# EAGLE board PKG900000001531 (EAGLE 7.7.0), part 1 of 3
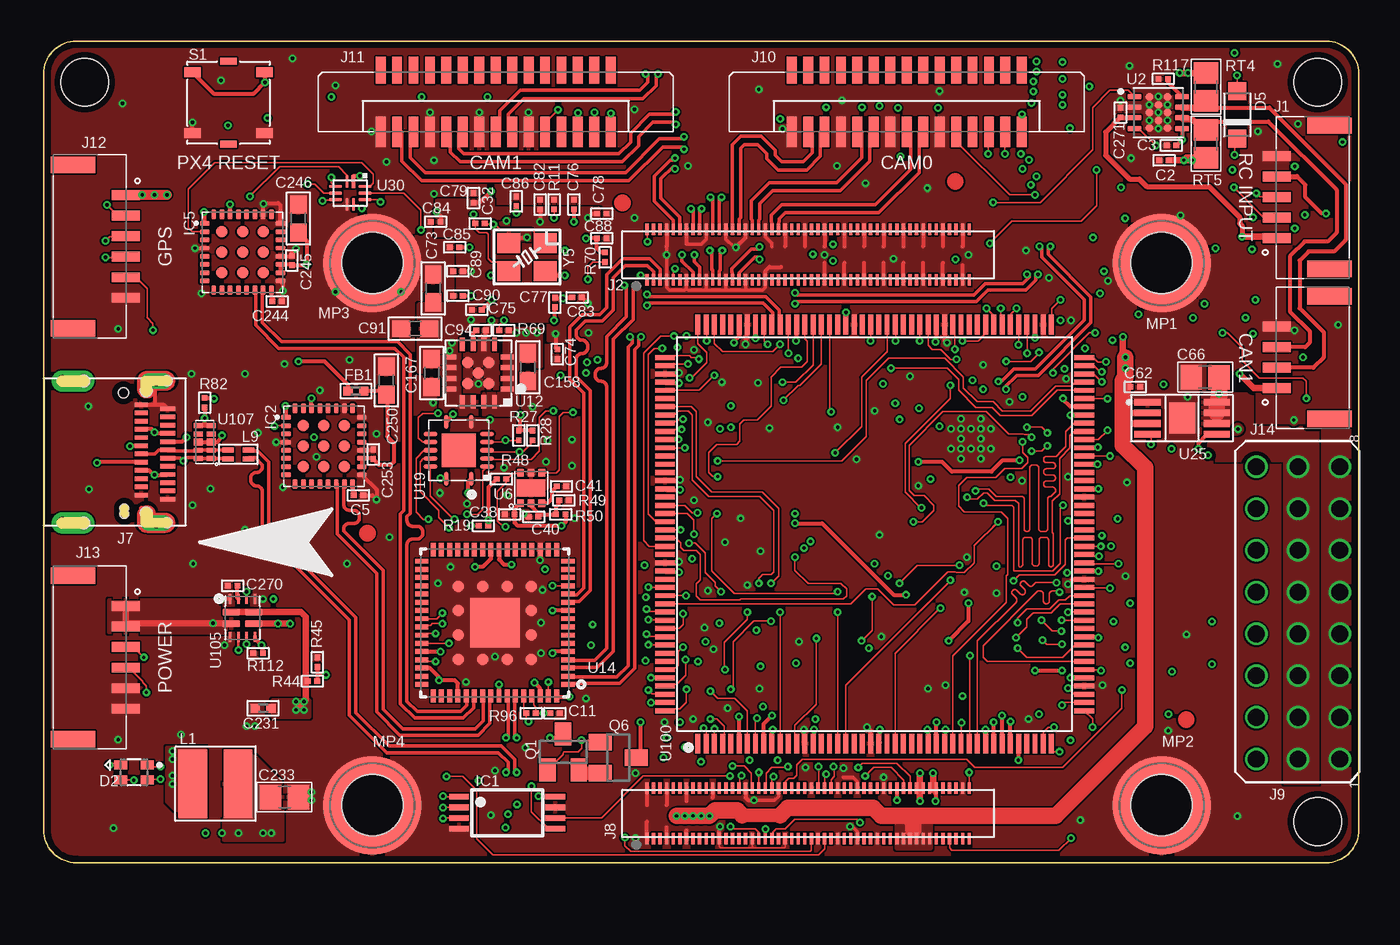
[diagram p32: board, top side]
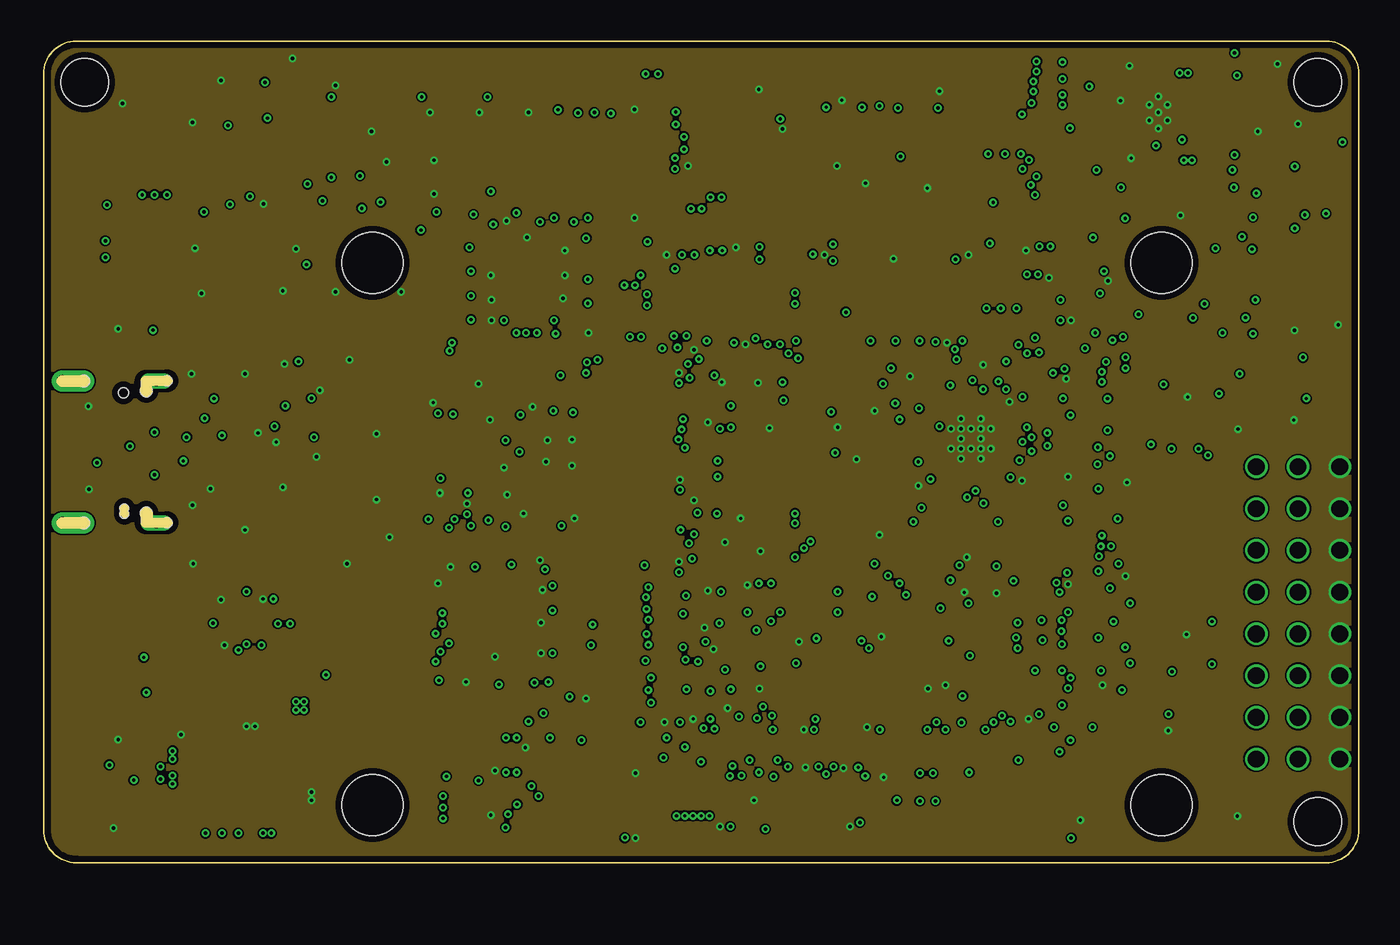
[diagram p33: board, inner layer GND]
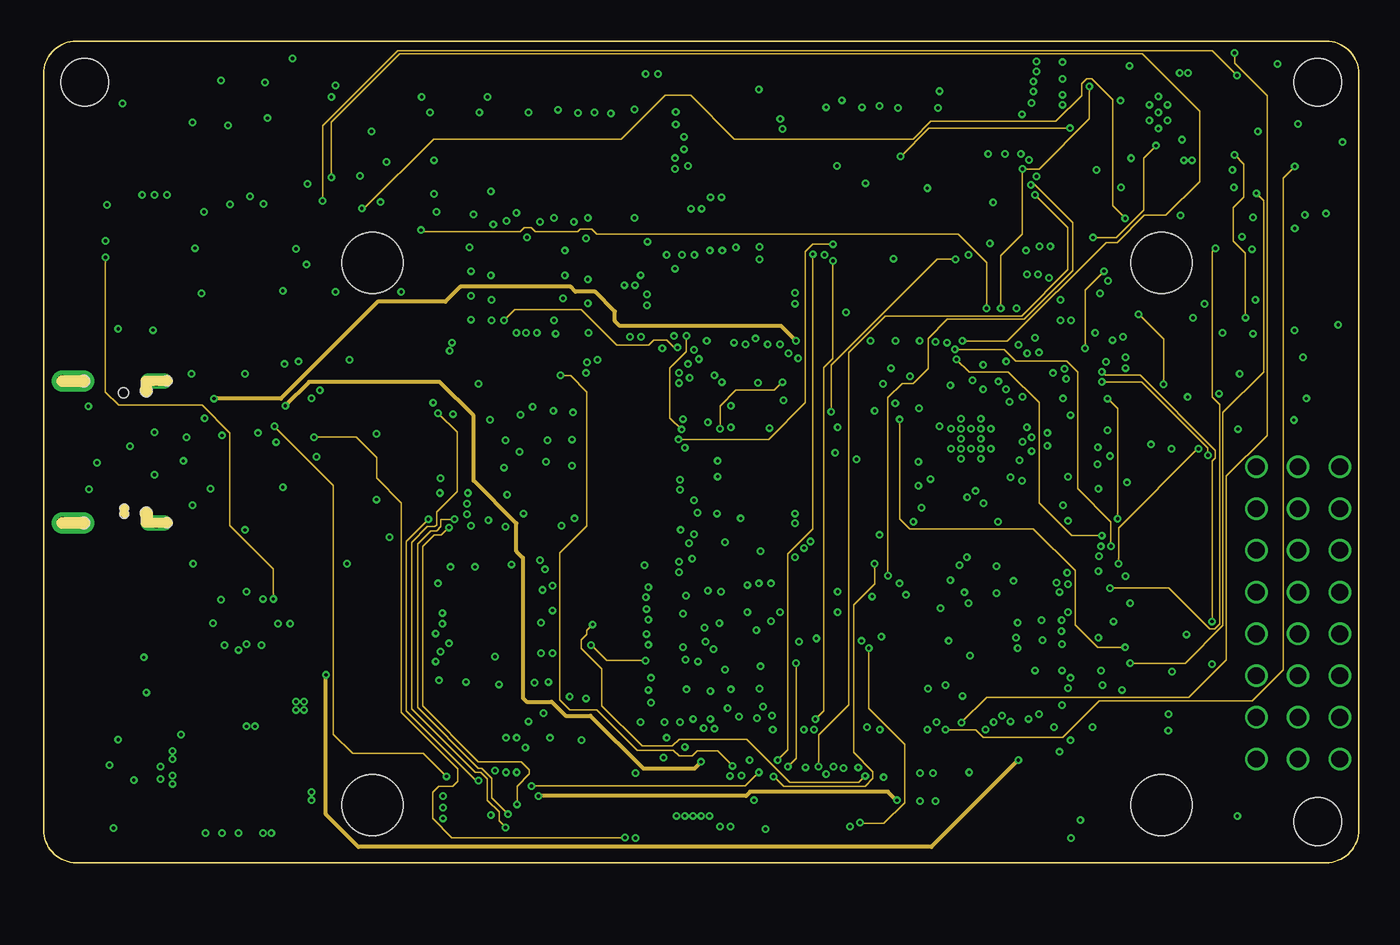
[diagram p34: board, inner layer S3]
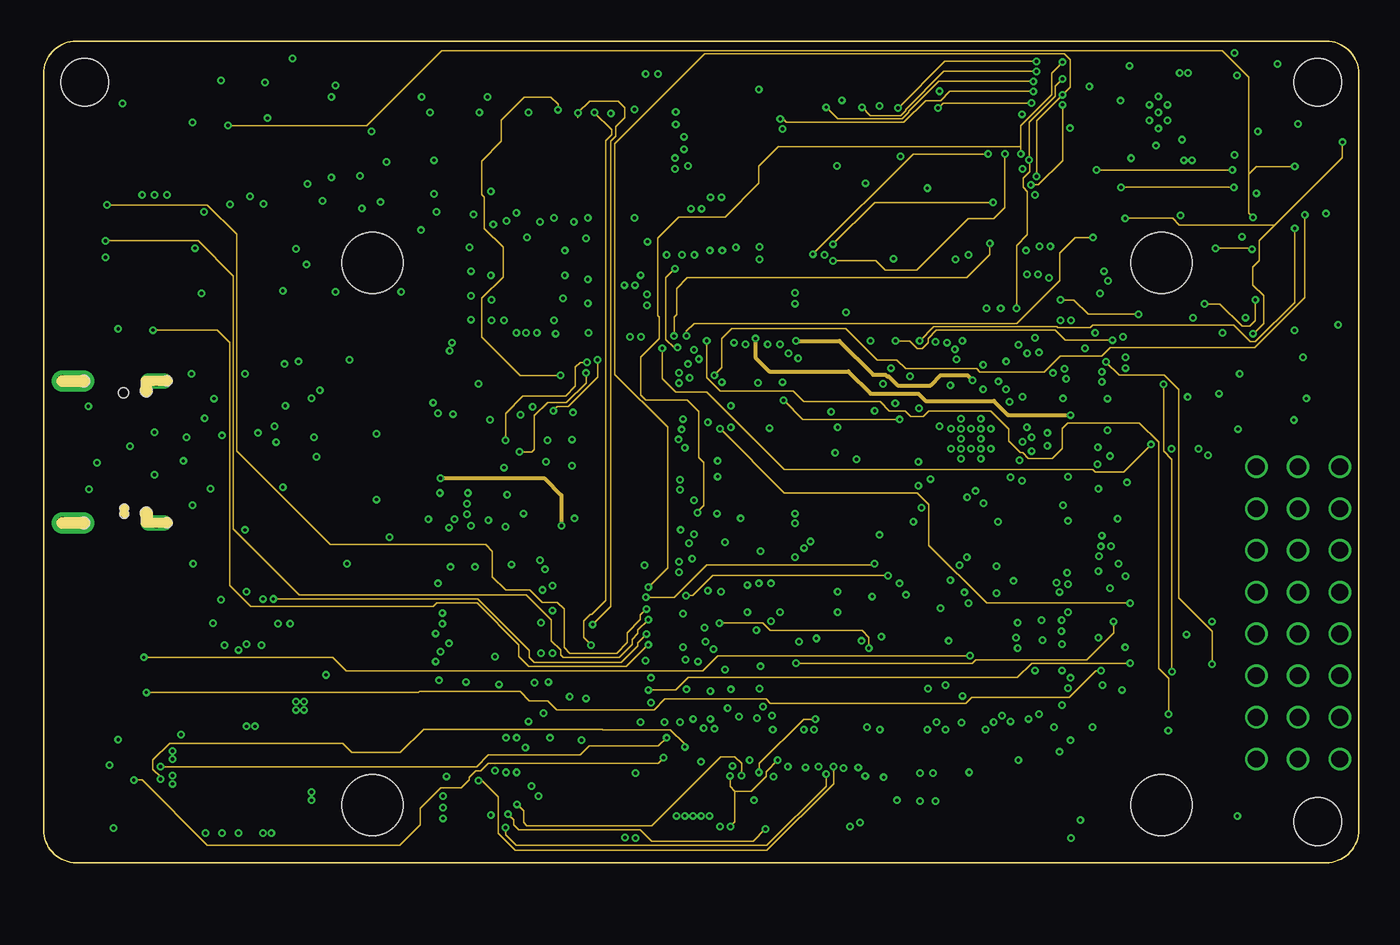
[diagram p35: board, inner layer S14]
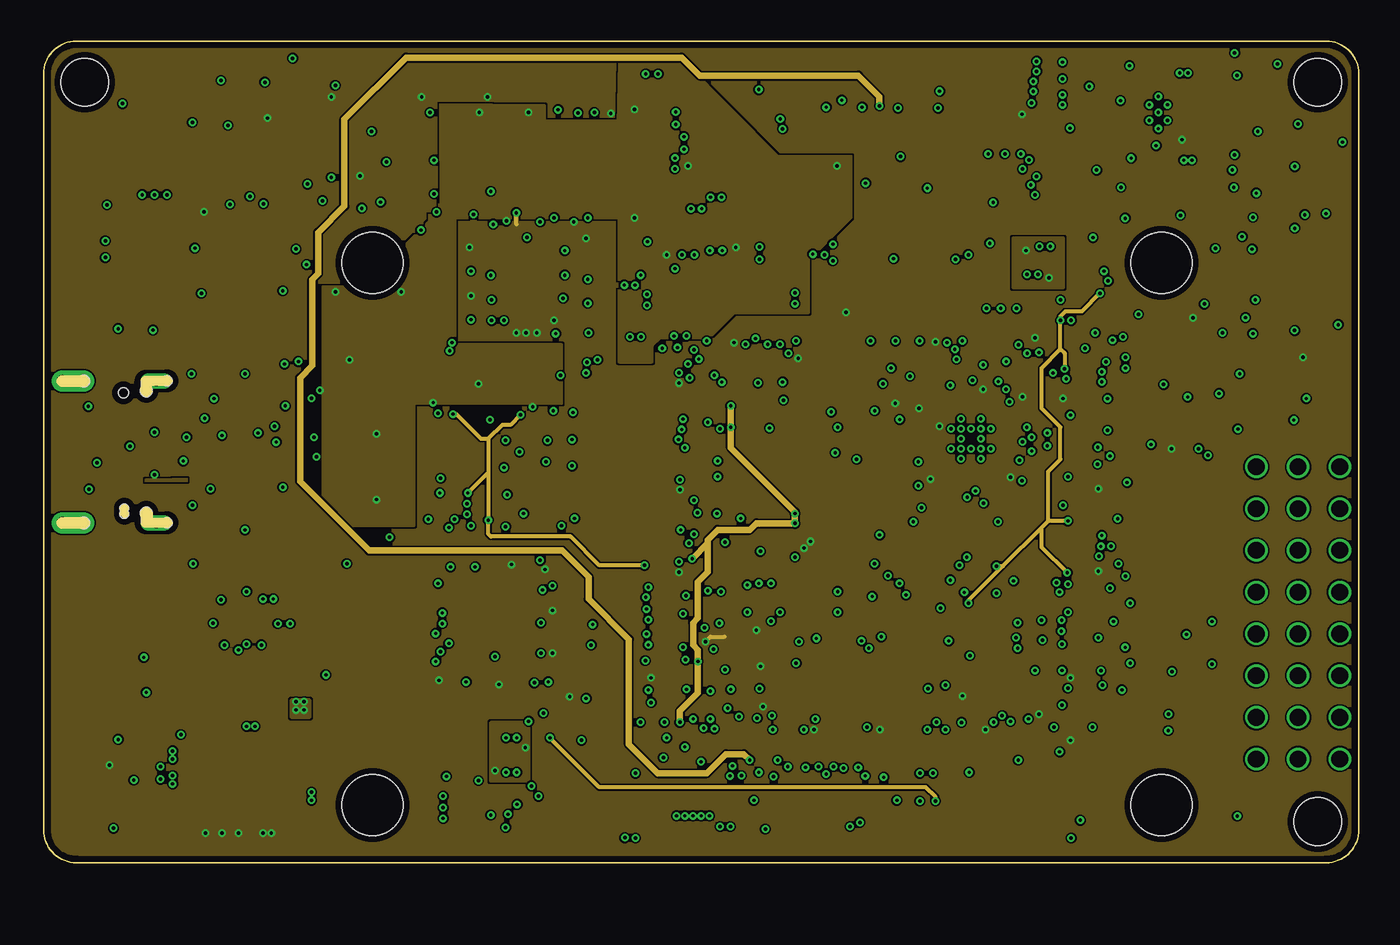
[diagram p36: board, inner layer Power]
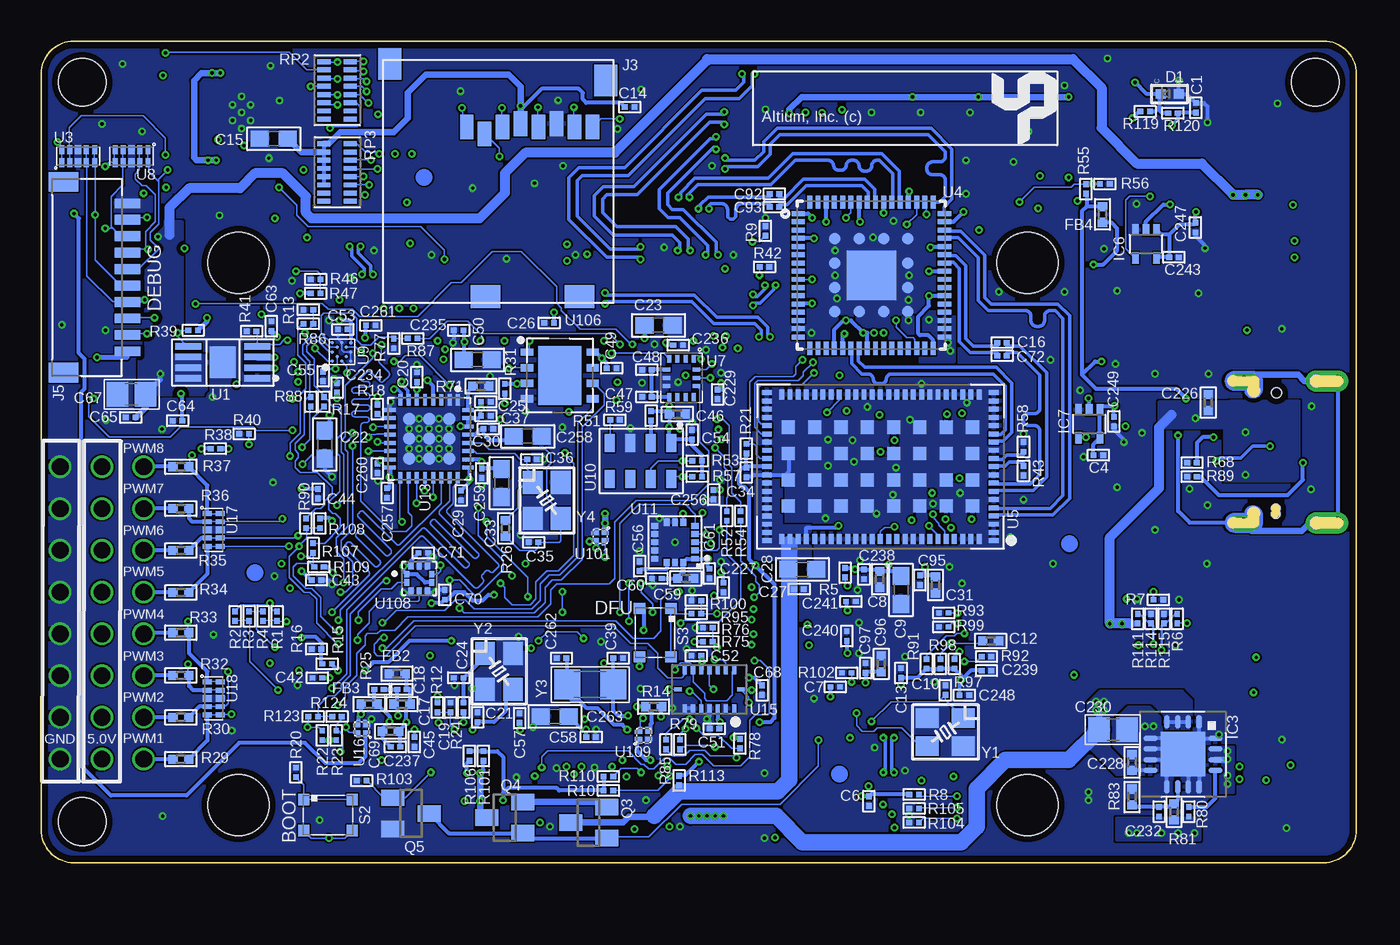
[diagram p37: board, bottom side, seen from below]

Size 80 x 50 mm. Coordinates in mm from the lower left corner, seen from the top.
Outline: 0,48 0,2 arc90 2,0 78,0 arc90 80,2 80,48 arc90 78,50 2,50 arc90 0,48
Copper layers (1+2*3+14*15+16): Top 0.035mm / dielectric 0.2mm / GND 0.035mm / dielectric 0.2mm / S3 0.035mm / dielectric 0.2mm / S14 0.035mm / dielectric 0.2mm / Power 0.035mm / dielectric 0.2mm / Bottom 0.035mm
Design rules "geppetto": minimum track width 4mil, minimum drill 8mil, track to track 4mil, track to pad 0.15mm, pad to pad 0.15mm, via to via 0.15mm, smd to smd 0mil, copper to edge 15mil, drill to drill 10mil, minimum pad ring 7mil, minimum via ring 5mil, stop-mask expansion 3mil, vias tented up to drill 20mil, thermal gap 0mil
Net classes: 1 supply: width 0.254 mm; 2 analog: width 0.178 mm; 4 xxwide: width 0.203 mm; 5 USB: width 0.2 mm, clearance 0.2 mm; 6 HDMI: width 0.2 mm, clearance 0.3 mm; 7 50_OHM: width 0.378 mm, clearance 0.3 mm
vRestrict: area 8.5,1.5 to 18,11; area 23.5,1 to 26.5,3; area 27,1 to 30,3

## Footprints (pad centres in the part's own frame; a part is rotated, then mirrored left to right if it is on the bottom)
0201 = smd 0.356 x 0.33: 1 -0.292,0; 2 0.292,0
0402 = smd 0.559 x 0.559: 1 -0.483,0; 2 0.483,0
0603 = smd 1.1 x 1: 1 -0.85,0; 2 0.85,0
0805 = smd 1.3 x 1.5: 1 -0.85,0; 2 0.85,0
D0402 = smd 0.6 x 0.6: P1 0,-0.55; P2 0,0.55
SMD4 = smd 0.8 x 0.55: 1 -0.8,-0.45; 2 -0.8,0.45; 3 0.8,0.45; 4 0.8,-0.45
SOD123F = smd 1.1 x 1.1: A -1.45,0; C 1.45,0
TSSOP8 = smd 0.35 x 1.2: 1 -0.975,-2.925; 2 -0.325,-2.925; 3 0.325,-2.925; 4 0.975,-2.925; 5 0.975,2.925; 6 0.325,2.925; 7 -0.325,2.925; 8 -0.975,2.925
QFN32 = smd 0.6 x 0.3: 1 -2.3,1.75; 2 -2.3,1.25; 3 -2.3,0.75; 4 -2.3,0.25; 5 -2.3,-0.25; 6 -2.3,-0.75; 7 -2.3,-1.25; 8 -2.3,-1.75; 17 2.3,-1.75; 18 2.3,-1.25; 19 2.3,-0.75; 20 2.3,-0.25; 21 2.3,0.25; 22 2.3,0.75; 23 2.3,1.25; 24 2.3,1.75 | smd 0.3 x 0.6: 9 -1.75,-2.3; 10 -1.25,-2.3; 11 -0.75,-2.3; 12 -0.25,-2.3; 13 0.25,-2.3; 14 0.75,-2.3; 15 1.25,-2.3; 16 1.75,-2.3; 25 1.75,2.3; 26 1.25,2.3; 27 0.75,2.3; 28 0.25,2.3; 29 -0.25,2.3; 30 -0.75,2.3; 31 -1.25,2.3; 32 -1.75,2.3 | smd 0.7 x 0.7: EXP1 -1.25,1.253; EXP2 1.25,1.25; EXP3 -1.25,-1.25; EXP4 1.25,-1.25; EXP5 0,1.25; EXP6 -1.25,0; EXP7 0,0; EXP8 1.25,0; EXP9 0,-1.25
PQFP16 = smd 0.85 x 0.35: 1 -1.975,0.975; 2 -1.975,0.325; 3 -1.975,-0.325; 4 -1.975,-0.975; 9 1.975,-0.975; 10 1.975,-0.325; 11 1.975,0.325; 12 1.975,0.975 | smd 0.35 x 0.85: 5 -0.975,-1.975; 6 -0.325,-1.975; 7 0.325,-1.975; 8 0.975,-1.975; 13 0.975,1.975; 14 0.325,1.975; 15 -0.325,1.975; 16 -0.975,1.975 | smd 2.7 x 2.7: P$1 0,0
SC70-5 = smd 0.4 x 0.7: 1 -0.65,-0.85; 2 0,-0.85; 3 0.65,-0.85; 4 0.65,0.85; 5 -0.65,0.85
JST-GH-5H = smd 0.6 x 1.7: P1 -2.5,1.85; P2 -1.25,1.85; P3 0,1.85; P4 1.25,1.85; P5 2.5,1.85 | smd 1 x 2.7: P$1 -4.35,-1.35; P$8 4.35,-1.35
HRS_DF40C-100DS-0.4V(51) = smd 0.2 x 0.7: 1 -9.8,-1.54; 2 -9.8,1.54; 3 -9.4,-1.54; 4 -9.4,1.54; 5 -9,-1.54; 6 -9,1.54; 7 -8.6,-1.54; 8 -8.6,1.54; 9 -8.2,-1.54; 10 -8.2,1.54; 11 -7.8,-1.54; 12 -7.8,1.54; 13 -7.4,-1.54; 14 -7.4,1.54; 15 -7,-1.54; 16 -7,1.54; 17 -6.6,-1.54; 18 -6.6,1.54; 19 -6.2,-1.54; 20 -6.2,1.54; 21 -5.8,-1.54; 22 -5.8,1.54; 23 -5.4,-1.54; 24 -5.4,1.54; 25 -5,-1.54; 26 -5,1.54; 27 -4.6,-1.54; 28 -4.6,1.54; 29 -4.2,-1.54; 30 -4.2,1.54; 31 -3.8,-1.54; 32 -3.8,1.54; 33 -3.4,-1.54; 34 -3.4,1.54; 35 -3,-1.54; 36 -3,1.54; 37 -2.6,-1.54; 38 -2.6,1.54; 39 -2.2,-1.54; 40 -2.2,1.54; 41 -1.8,-1.54; 42 -1.8,1.54; 43 -1.4,-1.54; 44 -1.4,1.54; 45 -1,-1.54; 46 -1,1.54; 47 -0.6,-1.54; 48 -0.6,1.54; 49 -0.2,-1.54; 50 -0.2,1.54; 51 0.2,-1.54; 52 0.2,1.54; 53 0.6,-1.54; 54 0.6,1.54; 55 1,-1.54; 56 1,1.54; 57 1.4,-1.54; 58 1.4,1.54; 59 1.8,-1.54; 60 1.8,1.54; 61 2.2,-1.54; 62 2.2,1.54; 63 2.6,-1.54; 64 2.6,1.54; 65 3,-1.54; 66 3,1.54; 67 3.4,-1.54; 68 3.4,1.54; 69 3.8,-1.54; 70 3.8,1.54; 71 4.2,-1.54; 72 4.2,1.54; 73 4.6,-1.54; 74 4.6,1.54; 75 5,-1.54; 76 5,1.54; 77 5.4,-1.54; 78 5.4,1.54; 79 5.8,-1.54; 80 5.8,1.54; 81 6.2,-1.54; 82 6.2,1.54; 83 6.6,-1.54; 84 6.6,1.54; 85 7,-1.54; 86 7,1.54; 87 7.4,-1.54; 88 7.4,1.54; 89 7.8,-1.54; 90 7.8,1.54; 91 8.2,-1.54; 92 8.2,1.54; 93 8.6,-1.54; 94 8.6,1.54; 95 9,-1.54; 96 9,1.54; 97 9.4,-1.54; 98 9.4,1.54; 99 9.8,-1.54; 100 9.8,1.54
USD = smd 0.813 x 1.5: 1 -1.915,3.306; 2 -0.823,2.9; 3 0.269,3.306; 4 1.361,3.509; 5 2.453,3.306; 6 3.546,3.509; 7 4.638,3.306; 8 5.73,3.306 | smd 1.803 x 1.397: CD1 4.955,-7.006 | smd 1.8 x 1.4: CD2 -0.76,-7.006 | smd 1.397 x 1.905: GND1 -6.602,7.15; GND3 6.556,6.151
SM10B-SRSS-TB = smd 0.6 x 1.55: 1 4.5,2.1; 2 3.5,2.1; 3 2.5,2.1; 4 1.5,2.1; 5 0.5,2.1; 6 -0.5,2.1; 7 -1.5,2.1; 8 -2.5,2.1; 9 -3.5,2.1; 10 -4.5,2.1 | smd 1.2 x 1.8: 11 5.8,-1.775; 12 -5.8,-1.775
USB-TYPE-C-SMT = smd 0.27 x 0.9: A1 -2.625,2.7; A2 -2.125,2.7; A3 -1.625,2.7; A4 -1.125,2.7; A5 -0.625,2.7; A6 -0.125,2.7; A7 0.375,2.7; A8 0.875,2.7; A9 1.375,2.7; A10 1.875,2.7; A11 2.375,2.7; A12 2.875,2.7 | smd 0.27 x 0.8: B1 2.625,1.1; B2 2.125,1.1; B3 1.625,1.1; B4 1.125,1.1; B5 0.625,1.1; B6 0.125,1.1; B7 -0.375,1.1; B8 -0.875,1.1; B9 -1.375,1.1; B10 -1.875,1.1; B11 -2.375,1.1; B12 -2.875,1.1 | drill 0.7 pad 1.3 offset: P$1 -4.32,-3.7; P$3 4.32,-3.7 | drill 0.6 pad 0.813 long: P$2 4.32,2; P$4 -4.32,2 | hole 0.6: -3.6,0; -4.32,2.65; 4.32,2.65 | hole 0.5: 3.425,0.065; 3.775,0.065 | hole 0.7: -4.32,-2.4; 4.32,-2.4; -3.72,1.4; 3.72,1.4
MA08-3W-0100 = drill 1.016: 1 -8.89,-2.54; 2 -6.35,-2.54; 3 -3.81,-2.54; 4 -1.27,-2.54; 5 1.27,-2.54; 6 3.81,-2.54; 7 6.35,-2.54; 8 8.89,-2.54; 9 -8.89,0; 10 -6.35,0; 11 -3.81,0; 12 -1.27,0; 13 1.27,0; 14 3.81,0; 15 6.35,0; 16 8.89,0; 17 -8.89,2.54; 18 -6.35,2.54; 19 -3.81,2.54; 20 -1.27,2.54; 21 1.27,2.54; 22 3.81,2.54; 23 6.35,2.54; 24 8.89,2.54
1-1734248-5 = smd 0.6 x 1.85: 1_1 7,0.025; 1_2 6,0.025; 1_3 5,0.025; 1_4 4,0.025; 1_5 3,0.025; 1_6 2,0.025; 1_7 1,0.025; 1_8 0,0.025; 1_9 -1,0.025; 1_10 -2,0.025; 1_11 -3,0.025; 1_12 -4,0.025; 1_13 -5,0.025; 1_14 -6,0.025; 1_15 -7,0.025 | smd 0.6 x 1.65: 2_1 7,-3.725; 2_2 6,-3.725; 2_3 5,-3.725; 2_4 4,-3.725; 2_5 3,-3.725; 2_6 2,-3.725; 2_7 1,-3.725; 2_8 0,-3.725; 2_9 -1,-3.725; 2_10 -2,-3.725; 2_11 -3,-3.725; 2_12 -4,-3.725; 2_13 -5,-3.725; 2_14 -6,-3.725; 2_15 -7,-3.725
JST-GH-6H = smd 0.6 x 1.7: P1 -3.125,1.85; P2 -1.875,1.85; P3 -0.625,1.85; P4 0.625,1.85; P5 1.875,1.85; P6 3.125,1.85 | smd 1 x 2.7: P$1 -4.975,-1.35; P$8 4.975,-1.35
JST-GH-4H = smd 0.6 x 1.7: P1 -1.875,1.85; P2 -0.625,1.85; P3 0.625,1.85; P4 1.875,1.85 | smd 1 x 2.7: P$1 -3.725,-1.35; P$8 3.725,-1.35
1515 = smd 1.75 x 4.2: 1 -1.375,0; 2 1.375,0
0504-DLP11S = smd 0.7 x 0.3: 1 -0.625,0.275; 2 0.625,0.275; 3 0.625,-0.275; 4 -0.625,-0.275
WA-SMSI_9774___151 = smd 6 x 6: 1 0,0 | hole 3.7: 0,0
SOT23 = smd 1 x 1.4: 1 -0.95,-1.1; 2 0.95,-1.1; 3 0,1.1
741X16 = smd 0.8 x 0.3: 1 -0.8,1.75; 2 -0.8,1.25; 3 -0.8,0.75; 4 -0.8,0.25; 5 -0.8,-0.25; 6 -0.8,-0.75; 7 -0.8,-1.25; 8 -0.8,-1.75; 9 0.8,-1.75; 10 0.8,-1.25; 11 0.8,-0.75; 12 0.8,-0.25; 13 0.8,0.25; 14 0.8,0.75; 15 0.8,1.25; 16 0.8,1.75
EVQ = smd 0.6 x 1: A@1 -1.85,2.2; A@2 -1.85,-2.2; B@1 1.85,2.2; B@2 1.85,-2.2 | smd 0.45 x 1: G@1 -2.525,0; G@2 2.525,0
KMT0 = smd 0.65 x 0.7: 1 -1.475,0.95; 2 1.475,0.95; 3 1.475,-0.95; 4 -1.475,-0.95
MSOP8-PAD = smd 0.4 x 1.6: 1 -0.975,-2.1; 2 -0.325,-2.1; 3 0.325,-2.1; 4 0.975,-2.1; 5 0.975,2.1; 6 0.325,2.1; 7 -0.325,2.1; 8 -0.975,2.1 | smd 1.89 x 1.57: TP 0,0
HVSON8 = smd 0.84 x 0.32: 1 -1.445,0.975; 2 -1.445,0.325; 3 -1.445,-0.325; 4 -1.445,-0.975; 5 1.445,-0.975; 6 1.445,-0.325; 7 1.445,0.325; 8 1.445,0.975 | smd 0.5 x 0.5: P$1 -0.55,0.95; P$2 0.55,0.95; P$3 -0.55,-0.95; P$4 0.55,-0.95; P$5 -0.55,0; P$6 0.55,0; P$8 0,0.475; P$9 0,-0.475
UFDFN-10 = smd 0.3 x 0.55: 1 -1,-0.385; 2 -0.5,-0.385; 4 0.5,-0.385; 5 1,-0.385; 6 1,0.385; 7 0.5,0.385; 9 -0.5,0.385; 10 -1,0.385 | smd 0.4 x 0.55: 3 0,-0.385; 8 0,0.385
QFN64-9X9MM-FT2232HQ = smd 0.8 x 0.3: 1 -4.45,3.75; 2 -4.45,3.25; 3 -4.45,2.75; 4 -4.45,2.25; 5 -4.45,1.75; 6 -4.45,1.25; 7 -4.45,0.75; 8 -4.45,0.25; 9 -4.45,-0.25; 10 -4.45,-0.75; 11 -4.45,-1.25; 12 -4.45,-1.75; 13 -4.45,-2.25; 14 -4.45,-2.75; 15 -4.45,-3.25; 16 -4.45,-3.75; 33 4.45,-3.75; 34 4.45,-3.25; 35 4.45,-2.75; 36 4.45,-2.25; 37 4.45,-1.75; 38 4.45,-1.25; 39 4.45,-0.75; 40 4.45,-0.25; 41 4.45,0.25; 42 4.45,0.75; 43 4.45,1.25; 44 4.45,1.75; 45 4.45,2.25; 46 4.45,2.75; 47 4.45,3.25; 48 4.45,3.75 | smd 0.3 x 0.8: 17 -3.75,-4.45; 18 -3.25,-4.45; 19 -2.75,-4.45; 20 -2.25,-4.45; 21 -1.75,-4.45; 22 -1.25,-4.45; 23 -0.75,-4.45; 24 -0.25,-4.45; 25 0.25,-4.45; 26 0.75,-4.45; 27 1.25,-4.45; 28 1.75,-4.45; 29 2.25,-4.45; 30 2.75,-4.45; 31 3.25,-4.45; 32 3.75,-4.45; 49 3.75,4.45; 50 3.25,4.45; 51 2.75,4.45; 52 2.25,4.45; 53 1.75,4.45; 54 1.25,4.45; 55 0.75,4.45; 56 0.25,4.45; 57 -0.25,4.45; 58 -0.75,4.45; 59 -1.25,4.45; 60 -1.75,4.45; 61 -2.25,4.45; 62 -2.75,4.45; 63 -3.25,4.45; 64 -3.75,4.45 | smd 3 x 3: 65 0,0 | smd 0.7 x 0.7: EPAD1 -2.22,2.22; EPAD2 -0.74,2.22; EPAD3 0.74,2.22; EPAD4 2.22,2.22; EPAD5 -2.22,0.74; EPAD6 -2.22,-0.74; EPAD7 -2.22,-2.22; EPAD8 -0.74,-2.22; EPAD9 0.74,-2.22; EPAD10 2.22,-2.22; EPAD11 2.22,-0.74; EPAD12 2.22,0.74
G313-06329-00 = smd 0.6 x 0.3: 1 -6.9,4.5; 2 -6.9,4; 3 -6.9,3.5; 4 -6.9,3; 5 -6.9,2.5; 6 -6.9,2; 7 -6.9,1.5; 8 -6.9,1; 9 -6.9,0.5; 10 -6.9,0; 11 -6.9,-0.5; 12 -6.9,-1; 13 -6.9,-1.5; 14 -6.9,-2; 15 -6.9,-2.5; 16 -6.9,-3; 17 -6.9,-3.5; 18 -6.9,-4; 19 -6.9,-4.5; 45 6.9,-4.5; 46 6.9,-4; 47 6.9,-3.5; 48 6.9,-3; 49 6.9,-2.5; 50 6.9,-2; 51 6.9,-1.5; 52 6.9,-1; 53 6.9,-0.5; 54 6.9,0; 55 6.9,0.5; 56 6.9,1; 57 6.9,1.5; 58 6.9,2; 59 6.9,2.5; 60 6.9,3; 61 6.9,3.5; 62 6.9,4; 63 6.9,4.5 | smd 0.3 x 0.6: 20 -6,-4.4; 21 -5.5,-4.4; 22 -5,-4.4; 23 -4.5,-4.4; 24 -4,-4.4; 25 -3.5,-4.4; 26 -3,-4.4; 27 -2.5,-4.4; 28 -2,-4.4; 29 -1.5,-4.4; 30 -1,-4.4; 31 -0.5,-4.4; 32 0,-4.4; 33 0.5,-4.4; 34 1,-4.4; 35 1.5,-4.4; 36 2,-4.4; 37 2.5,-4.4; 38 3,-4.4; 39 3.5,-4.4; 40 4,-4.4; 41 4.5,-4.4; 42 5,-4.4; 43 5.5,-4.4; 44 6,-4.4; 64 6,4.4; 65 5.5,4.4; 66 5,4.4; 67 4.5,4.4; 68 4,4.4; 69 3.5,4.4; 70 3,4.4; 71 2.5,4.4; 72 2,4.4; 73 1.5,4.4; 74 1,4.4; 75 0.5,4.4; 76 0,4.4; 77 -0.5,4.4; 78 -1,4.4; 79 -1.5,4.4; 80 -2,4.4; 81 -2.5,4.4; 82 -3,4.4; 83 -3.5,4.4; 84 -4,4.4; 85 -4.5,4.4; 86 -5,4.4; 87 -5.5,4.4; 88 -6,4.4 | smd 0.8 x 0.8: 89 -5.6,2.4; 90 -4,2.4; 91 -2.4,2.4; 92 -0.8,2.4; 93 0.8,2.4; 94 2.4,2.4; 95 4,2.4; 96 5.6,2.4; 97 -5.6,0.8; 98 -4,0.8; 99 -2.4,0.8; 100 -0.8,0.8; 101 0.8,0.8; 102 2.4,0.8; 103 4,0.8; 104 5.6,0.8; 105 -5.6,-0.8; 106 -4,-0.8; 107 -2.4,-0.8; 108 -0.8,-0.8; 109 0.8,-0.8; 110 2.4,-0.8; 111 4,-0.8; 112 5.6,-0.8; 113 -5.6,-2.4; 114 -4,-2.4; 115 -2.4,-2.4; 116 -0.8,-2.4; 117 0.8,-2.4; 118 2.4,-2.4; 119 4,-2.4; 120 5.6,-2.4
WDFN6 = smd 0.4 x 0.45: 1 -0.65,-0.925; 2 0,-0.925; 3 0.65,-0.925; 4 0.65,0.925; 5 0,0.925; 6 -0.65,0.925 | smd 1.72 x 1.05: EPAD 0,0
LGA14-2.5X3MM = smd 0.475 x 0.25: 1 -1.163,0.75; 2 -1.163,0.25; 3 -1.163,-0.25; 4 -1.163,-0.75; 8 1.163,-0.75; 9 1.163,-0.25; 10 1.163,0.25; 11 1.163,0.75 | smd 0.25 x 0.475: 5 -0.5,-0.912; 6 0,-0.912; 7 0.5,-0.912; 12 0.5,0.912; 13 0,0.912; 14 -0.5,0.912
WLCSP-12 = smd 0.2 x 0.2: A1 0.584,0.584; A3 0.584,0.018; A5 0.584,-0.548; B2 0.301,0.301; B4 0.301,-0.265; C1 0.018,0.584; C5 0.018,-0.548; D2 -0.265,0.301; D4 -0.265,-0.265; E1 -0.548,0.584; E3 -0.548,0.018; E5 -0.548,-0.548
BA03 = smd 1.1 x 0.6: 1 -1.1,1.875; 2 -1.1,0.625; 3 -1.1,-0.625; 4 -1.1,-1.875; 5 1.1,-1.875; 6 1.1,-0.625; 7 1.1,0.625; 8 1.1,1.875
LGA16-3X3MM = smd 0.45 x 0.35: 1 -1.225,1; 2 -1.225,0.5; 3 -1.225,0; 4 -1.225,-0.5; 5 -1.225,-1; 9 1.225,-1; 10 1.225,-0.5; 11 1.225,0; 12 1.225,0.5; 13 1.225,1 | smd 0.35 x 0.45: 6 -0.5,-1.225; 7 0,-1.225; 8 0.5,-1.225; 14 0.5,1.225; 15 0,1.225; 16 -0.5,1.225
LFCSPWQ16 = smd 0.8 x 0.3: 1 -1.75,0.975; 2 -1.75,0.325; 3 -1.75,-0.325; 4 -1.75,-0.975; 9 1.75,-0.975; 10 1.75,-0.325; 11 1.75,0.325; 12 1.75,0.975 | smd 0.3 x 0.8: 5 -0.975,-1.75; 6 -0.325,-1.75; 7 0.325,-1.75; 8 0.975,-1.75; 13 0.975,1.75; 14 0.325,1.75; 15 -0.325,1.75; 16 -0.975,1.75 | smd 0.7 x 0.7: EP 0,0; EP1 -0.64,0.64; EP2 0.64,0.64; EP3 -0.64,-0.64; EP4 0.64,-0.64
QFN32-USB3300 = smd 0.69 x 0.24: 1 -2.37,1.75; 2 -2.37,1.25; 3 -2.37,0.75; 4 -2.37,0.25; 5 -2.37,-0.25; 6 -2.37,-0.75; 7 -2.37,-1.25; 8 -2.37,-1.75; 17 2.37,-1.75; 18 2.37,-1.25; 19 2.37,-0.75; 20 2.37,-0.25; 21 2.37,0.25; 22 2.37,0.75; 23 2.37,1.25; 24 2.37,1.75 | smd 0.24 x 0.69: 9 -1.75,-2.37; 10 -1.25,-2.374; 11 -0.75,-2.37; 12 -0.25,-2.37; 13 0.25,-2.37; 14 0.75,-2.37; 15 1.25,-2.37; 16 1.75,-2.37; 25 1.75,2.37; 26 1.25,2.37; 27 0.75,2.37; 28 0.25,2.37; 29 -0.25,2.37; 30 -0.75,2.37; 31 -1.25,2.37; 32 -1.75,2.37 | smd 0.75 x 0.75: FLAG_1 -1.21,1.21; FLAG_2 0,1.21; FLAG_3 1.21,1.21; FLAG_4 -1.21,0; FLAG_5 0,0; FLAG_6 1.21,0; FLAG_7 -1.21,-1.21; FLAG_8 0,-1.21; FLAG_9 1.21,-1.21
LGA16-BMI088 = smd 0.475 x 0.25: 1 1.16,1.5; 2 1.16,1; 3 1.16,0.5; 4 1.16,0; 5 1.16,-0.5; 6 1.16,-1; 7 1.16,-1.5; 9 -1.16,-1.5; 10 -1.16,-1; 11 -1.16,-0.5; 12 -1.16,0; 13 -1.16,0.5; 14 -1.16,1; 15 -1.16,1.5 | smd 0.25 x 0.475: 8 0,-1.915; 16 0,1.915
FTDFN-4 = smd 0.23 x 0.44: 1_1 -0.205,-0.31; 2_1 0.205,-0.31; 3_1 0.205,0.31; 4_1 -0.205,0.31 | smd 0.21 x 0.23: 1_2 -0.425,-0.205; 2_2 0.425,-0.205; 3_2 0.425,0.205; 4_2 -0.425,0.205
S-PVQFN-N14 = smd 0.85 x 0.28: 1 -1.725,-0.75; 7 1.725,-0.75; 8 1.725,0.75; 14 -1.725,0.75 | smd 0.28 x 0.85: 2 -1,-1.725; 3 -0.5,-1.725; 4 0,-1.725; 5 0.5,-1.725; 6 1,-1.725; 9 1,1.725; 10 0.5,1.725; 11 0,1.725; 12 -0.5,1.725; 13 -1,1.725 | smd 2.05 x 2.05: PAD 0,0
UQFN-10 = smd 0.2 x 0.8: 1 -0.2,-0.7; 2 0.2,-0.7; 6 0.2,0.7; 7 -0.2,0.7 | smd 0.8 x 0.2: 3 0.9,-0.4; 4 0.9,0; 5 0.9,0.4; 8 -0.9,0.4; 9 -0.9,0; 10 -0.9,-0.4
LQFP176 = smd 0.3 x 1.2: 1 -10.75,-12.75; 2 -10.25,-12.75; 3 -9.75,-12.75; 4 -9.25,-12.75; 5 -8.75,-12.75; 6 -8.25,-12.75; 7 -7.75,-12.75; 8 -7.25,-12.75; 9 -6.75,-12.75; 10 -6.25,-12.75; 11 -5.75,-12.75; 12 -5.25,-12.75; 13 -4.75,-12.75; 14 -4.25,-12.75; 15 -3.75,-12.75; 16 -3.25,-12.75; 17 -2.75,-12.75; 18 -2.25,-12.75; 19 -1.75,-12.75; 20 -1.25,-12.75; 21 -0.75,-12.75; 22 -0.25,-12.75; 23 0.25,-12.75; 24 0.75,-12.75; 25 1.25,-12.75; 26 1.75,-12.75; 27 2.25,-12.75; 28 2.75,-12.75; 29 3.25,-12.75; 30 3.75,-12.75; 31 4.25,-12.75; 32 4.75,-12.75; 33 5.25,-12.75; 34 5.75,-12.75; 35 6.25,-12.75; 36 6.75,-12.75; 37 7.25,-12.75; 38 7.75,-12.75; 39 8.25,-12.75; 40 8.75,-12.75; 41 9.25,-12.75; 42 9.75,-12.75; 43 10.25,-12.75; 44 10.75,-12.75; 89 10.75,12.75; 90 10.25,12.75; 91 9.75,12.75; 92 9.25,12.75; 93 8.75,12.75; 94 8.25,12.75; 95 7.75,12.75; 96 7.25,12.75; 97 6.75,12.75; 98 6.25,12.75; 99 5.75,12.75; 100 5.25,12.75; 101 4.75,12.75; 102 4.25,12.75; 103 3.75,12.75; 104 3.25,12.75; 105 2.75,12.75; 106 2.25,12.75; 107 1.75,12.75; 108 1.25,12.75; 109 0.75,12.75; 110 0.25,12.75; 111 -0.25,12.75; 112 -0.75,12.75; 113 -1.25,12.75; 114 -1.75,12.75; 115 -2.25,12.75; 116 -2.75,12.75; 117 -3.25,12.75; 118 -3.75,12.75; 119 -4.25,12.75; 120 -4.75,12.75; 121 -5.25,12.75; 122 -5.75,12.75; 123 -6.25,12.75; 124 -6.75,12.75; 125 -7.25,12.75; 126 -7.75,12.75; 127 -8.25,12.75; 128 -8.75,12.75; 129 -9.25,12.75; 130 -9.75,12.75; 131 -10.25,12.75; 132 -10.75,12.75 | smd 1.2 x 0.3: 45 12.75,-10.75; 46 12.75,-10.25; 47 12.75,-9.75; 48 12.75,-9.25; 49 12.75,-8.75; 50 12.75,-8.25; 51 12.75,-7.75; 52 12.75,-7.25; 53 12.75,-6.75; 54 12.75,-6.25; 55 12.75,-5.75; 56 12.75,-5.25; 57 12.75,-4.75; 58 12.75,-4.25; 59 12.75,-3.75; 60 12.75,-3.25; 61 12.75,-2.75; 62 12.75,-2.25; 63 12.75,-1.75; 64 12.75,-1.25; 65 12.75,-0.75; 66 12.75,-0.25; 67 12.75,0.25; 68 12.75,0.75; 69 12.75,1.25; 70 12.75,1.75; 71 12.75,2.25; 72 12.75,2.75; 73 12.75,3.25; 74 12.75,3.75; 75 12.75,4.25; 76 12.75,4.75; 77 12.75,5.25; 78 12.75,5.75; 79 12.75,6.25; 80 12.75,6.75; 81 12.75,7.25; 82 12.75,7.75; 83 12.75,8.25; 84 12.75,8.75; 85 12.75,9.25; 86 12.75,9.75; 87 12.75,10.25; 88 12.75,10.75; 133 -12.75,10.75; 134 -12.75,10.25; 135 -12.75,9.75; 136 -12.75,9.25; 137 -12.75,8.75; 138 -12.75,8.25; 139 -12.75,7.75; 140 -12.75,7.25; 141 -12.75,6.75; 142 -12.75,6.25; 143 -12.75,5.75; 144 -12.75,5.25; 145 -12.75,4.75; 146 -12.75,4.25; 147 -12.75,3.75; 148 -12.75,3.25; 149 -12.75,2.75; 150 -12.75,2.25; 151 -12.75,1.75; 152 -12.75,1.25; 153 -12.75,0.75; 154 -12.75,0.25; 155 -12.75,-0.25; 156 -12.75,-0.75; 157 -12.75,-1.25; 158 -12.75,-1.75; 159 -12.75,-2.25; 160 -12.75,-2.75; 161 -12.75,-3.25; 162 -12.75,-3.75; 163 -12.75,-4.25; 164 -12.75,-4.75; 165 -12.75,-5.25; 166 -12.75,-5.75; 167 -12.75,-6.25; 168 -12.75,-6.75; 169 -12.75,-7.25; 170 -12.75,-7.75; 171 -12.75,-8.25; 172 -12.75,-8.75; 173 -12.75,-9.25; 174 -12.75,-9.75; 175 -12.75,-10.25; 176 -12.75,-10.75
VQFN12-HR = smd 1.05 x 0.4: 1 -0.675,0.35; 2 -0.675,-0.35; 7 0.675,-0.35; 8 0.675,0.35 | smd 0.2 x 0.6: 3 -0.75,-1.15; 4 -0.25,-1.15; 5 0.25,-1.15; 6 0.75,-1.15; 9 0.75,1.15; 10 0.25,1.15; 11 -0.25,1.15; 12 -0.75,1.15
DFN8-4X4.5 = smd 0.75 x 0.45: 1 -2,1.425; 2 -2,0.475; 3 -2,-0.475; 4 -2,-1.425; 5 2,-1.425; 6 2,-0.475; 7 2,0.475; 8 2,1.425 | smd 2.6 x 3.6: 9 0,0
LGA10 = smd 0.35 x 0.38: 1 -0.765,0.25; 2 -0.765,-0.25; 3 -0.5,-0.765; 4 0,-0.765; 5 0.5,-0.765; 6 0.765,-0.25; 7 0.765,0.25; 8 0.5,0.765; 9 0,0.765; 10 -0.5,0.765
GEPPETTO_HOLE_2.9 = hole 2.9: 0,0
CRYSTAL-3225 = smd 1.4 x 1.2: 1 -1.1,-0.85; 2 1.1,-0.85; 3 1.1,0.85; 4 -1.1,0.85
1206 = smd 1.6 x 1.8: 1 -1.4,0; 2 1.4,0

## Placement (x,y rotation side)
C1  47pF  [0201]  9.77,45.94 90 bottom
C2  4.7nF  [0201]  68.15,42.75 180 top
C3  0.1uF  [0201]  68.6,43.65 180 top
C4  0.1uF  [0201]  15.7,24.8 0 bottom
C5  0.1uF  [0201]  19.15,22.35 0 top
C6  0.1uF  [0201]  29.65,3.75 270 bottom
C7  0.1uF  [0201]  31.7,10.7 0 bottom
C8  1.0uF  [0402]  29,17.25 270 bottom
C9  4.7uF  [0603]  27.7,16.6 270 bottom
C10  22pF  [0201]  25,10.5 90 bottom
C11  22pF  [0201]  31.1,9.1 0 top
C12  0.1uF  [0402]  22.25,13.5 0 bottom
C13  0.1uF  [0201]  27.7,11.55 90 bottom
C14  0.1uF  [0201]  44.2,45.99 0 bottom
C15  10uF  [0603]  65.85,44.06 180 bottom
C16  0.1uF  [0201]  21.55,31.65 180 bottom
C17  1.0uF  [0402]  58.05,9.65 0 bottom
C18  0.1uF  [0201]  58.05,10.55 0 bottom
C19  0.1uF  [0201]  55.1,9.45 90 bottom
C20  0.1uF  [0201]  57.15,29.55 90 bottom
C21  22pF  [0201]  53.45,8.85 90 bottom
C22  2.2uF  [0603]  62.75,25.45 270 bottom
C23  2.2uF  [0603]  42.45,32.7 0 bottom
C24  22pF  [0201]  54.6,11.25 180 bottom
C25  0.1uF  [0201]  52.95,28.05 0 bottom
C26  0.1uF  [0201]  49.1,32.85 180 bottom
C27  0.1uF  [0201]  33.9,16.65 0 bottom
C28  10uF  [0603]  33.7,17.85 0 bottom
C29  0.1uF  [0201]  54.45,22.35 270 bottom
C30  0.1uF  [0201]  52.8,26.4 0 bottom
C31  1.0uF  [0402]  25.6,16.9 270 bottom
C32  10pF  [0201]  26.55,38.9 0 top
C33  4.7uF  [0603]  52,23.1 270 bottom
C34  0.1uF  [0201]  37.1,23.75 270 bottom
C35  22pF  [0201]  50.05,19.5 180 bottom
C36  22pF  [0201]  50.15,24.55 0 bottom
C37  0.1uF  [0201]  52.95,27.2 0 bottom
C38  0.1uF  [0201]  28.35,21.2 180 top
C39  2.2pF  [0201]  44.9,12.45 0 bottom
C40  1000pF  [0201]  29.8,21.05 180 top
C41  270pF  [0201]  31.5,22.9 0 top
C42  0.1uF  [0201]  63.2,11.25 180 bottom
C43  0.1uF  [0201]  63.25,17.2 0 bottom
C44  0.1uF  [0201]  63.15,22.45 270 bottom
C45  0.1uF  [0201]  57.3,7.35 270 bottom
C46  2.2uF  [0402]  41.3,27.3 0 bottom
C47  0.1uF  [0201]  43.15,28.35 180 bottom
C48  22nF  [0201]  43.15,30 180 bottom
C49  0.1uF  [0201]  45.3,30.1 0 bottom
C50  4.7uF  [0603]  53.45,30.6 0 bottom
C51  0.1uF  [0201]  39.05,8.15 180 bottom
C52  0.1uF  [0201]  40.15,12.6 180 bottom
C53  0.1uF  [0201]  61.65,32.45 180 bottom
C54  DNP  [0201]  40.4,26.05 90 bottom
C55  0.1uF  [0201]  62.85,29.6 270 bottom
C56  0.1uF  [0201]  43.6,18.05 90 bottom
C57  0.1uF  [0201]  50.9,8.8 90 bottom
C58  0.1uF  [0201]  46.55,7.65 0 bottom
C59  2.2uF  [0402]  40.8,17.3 0 bottom
C60  0.1uF  [0201]  42.55,17.3 180 bottom
C61  22nF  [0201]  39.35,17.6 270 bottom
C62  0.1uF  [0201]  66.4,28.95 0 top
C63  0.1uF  [0201]  66,32.65 90 bottom
C64  0.1uF  [0201]  71.7,26.9 180 bottom
C65  0.1uF  [0201]  74.55,27.1 180 bottom
C66  22uF  [0805]  70.65,29.55 180 top
C67  22uF  [0805]  74.5,28.5 180 bottom
C68  0.1uF  [0201]  36.15,10.5 270 bottom
C69  1.0uF  [0402]  58.75,8 0 bottom
C70  0.1uF  [0201]  55.45,16.3 90 bottom
C71  0.1uF  [0201]  56.75,18.85 0 bottom
C72  0.1uF  [0201]  21.55,30.85 180 bottom
C73  0.1uF  [0201]  25.2,34.5 180 top
C74  0.1uF  [0201]  31.25,30.95 270 top
C75  0.1uF  [0201]  26.35,33.65 0 top
C76  0.1uF  [0201]  32.25,40.05 90 top
C77  0.1uF  [0201]  31.1,34.1 90 top
C78  0.1uF  [0201]  33.95,39.5 0 top
C79  0.1uF  [0201]  26.15,40.45 90 top
C82  0.1uF  [0201]  30.2,40.05 90 top
C83  0.1uF  [0201]  32.45,34.4 180 top
C84  0.1uF  [0201]  23.85,39 180 top
C85  0.1uF  [0201]  25,37.45 180 top
C86  0.1uF  [0201]  28.75,40.25 90 top
C88  0.1uF  [0201]  33.95,38 0 top
C89  0.1uF  [0201]  25.2,36 180 top
C90  4.7uF / 16V  [0603]  23.7,34.95 90 top
C91  4.7uF / 16V  [0603]  22.6,32.5 180 top
C92  0.1uF  [0201]  35.4,40.7 0 bottom
C93  0.1uF  [0201]  35.4,39.9 0 bottom
C94  6.8nF  [0201]  26.6,32.4 0 top
C95  0.1uF  [0201]  26.55,17.2 270 bottom
C96  1.0uF  [0402]  28.9,12.1 90 bottom
C97  0.1uF  [0201]  29.85,11.85 90 bottom
C158  10uF  [0603]  29.45,30.15 270 top
C167  10uF  [0603]  23.6,29.8 270 top
C226  1.0uF  [0402]  9.01,28 90 bottom
C227  0.1uF  [0201]  38.5,16.75 270 bottom
C228  0.1uF / 16V  [0402]  13.65,6.1 90 bottom
C229  0.1uF  [0201]  38.85,28.5 270 bottom
C230  10uF / 16V  [0805]  14.8,8.1 0 bottom
C231  1.0uF  [0402]  13.35,9.4 180 top
C232  10pF  [0201]  12,3.1 90 bottom
C233  22uF  [0805]  14.65,4 0 top
C234  0.1uF  [0201]  62,28.9 90 bottom
C235  0.1uF  [0201]  54.6,32.4 180 bottom
C236  0.1uF  [0201]  41.25,31.5 0 bottom
C237  0.1uF  [0201]  58.45,7.05 0 bottom
C238  0.1uF  [0201]  29.95,17.55 270 bottom
C239  0.1uF  [0201]  22.5,11.7 0 bottom
C240  0.1uF  [0201]  31,13.8 90 bottom
C241  0.1uF  [0201]  30.75,15.9 0 bottom
C243  0.1uF  [0201]  11.1,36.85 0 bottom
C244  0.1uF  [0201]  14.2,34.15 0 top
C245  0.1uF  [0201]  15.1,36.65 90 top
C246  4.7uF  [0603]  15.5,39.2 90 top
C247  0.1uF  [0201]  9.8,38.65 270 bottom
C248  0.1uF  [0201]  23.85,10.2 0 bottom
C249  0.1uF  [0201]  14.75,26.85 270 bottom
C250  4.7uF  [0603]  20.85,29.35 90 top
C253  0.1uF  [0201]  20.05,24.85 90 top
C256  0.1uF  [0201]  39.1,22.4 270 bottom
C257  0.1uF  [0201]  58.95,22.5 270 bottom
C258  4.7uF  [0603]  50.4,25.95 0 bottom
C259  0.1uF  [0201]  53.2,23.7 270 bottom
C260  0.1uF  [0201]  59.55,24 270 bottom
C261  0.1uF  [0201]  59.95,32.7 0 bottom
C262  2.2pF  [0201]  48.35,12.45 180 bottom
C263  4.7uF  [0603]  48.75,8.9 180 bottom
C270  0.01uF  [0201]  11.5,16.85 180 top
C271  0.1uF  [0201]  65.5,45.65 90 top
D1  B72590D50A060  [D0402]  11.36,46.78 90 bottom
D2  EAST1616RGBB4  [SMD4]  5.5,5.5 180 top
D5  PMEG2010  [SOD123F]  72.6,45.5 270 top
FB1  120R 1A  [0402]  19,28.7 0 top
FB2  120R 1A  [0402]  58.35,11.5 0 bottom
FB3  120R 1A  [0402]  60.05,9.65 0 bottom
FB4  120R 1A  [0402]  15.45,39.45 270 bottom
FD1  DNP  [FIDUCIAL]  19.7,20.05 0 top
FD2  DNP  [FIDUCIAL]  55.45,41.45 0 top
FD3  DNP  [FIDUCIAL]  69.5,8.7 0 top
FD4  DNP  [FIDUCIAL]  35.2,40.15 0 top
FD5  DNP  [FIDUCIAL]  31.45,5.4 0 bottom
FD6  DNP  [FIDUCIAL]  56.7,41.7 0 bottom
FD7  DNP  [FIDUCIAL]  67,17.65 0 bottom
FD8  DNP  [FIDUCIAL]  17.45,19.4 0 bottom
IC1  CAT24C256YI-G  [TSSOP8]  28.2,3.05 270 top
IC2  FT232RQ  [QFN32]  17.05,25.35 0 top
IC3  TPS62111  [PQFP16]  10.55,6.6 270 bottom
IC5  FT232RQ  [QFN32]  12.1,37.15 0 top
IC6  SN74LVC1G126DCKR  [SC70-5]  12.8,37.65 180 bottom
IC7  SN74LVC1G126DCKR  [SC70-5]  16.25,26.7 180 bottom
J1  JST-GH-5H  [JST-GH-5H]  76.86,40.5 90 top
J2  DF40HC(3.0)-100DS-0.4V(51)  [HRS_DF40C-100DS-0.4V(51)]  46.5,37 0 top
J3  USD_WURTH  [USD]  52.2,41.46 0 bottom
J5  SM10B-SRSS-TB  [SM10B-SRSS-TB]  76.86,35.62 270 bottom
J7  USB-TYPE-C  [USB-TYPE-C-SMT]  4.85,25 270 top
J8  DF40HC(3.0)-100DS-0.4V(51)  [HRS_DF40C-100DS-0.4V(51)]  46.5,3 0 top
J9  CON8X3STD  [MA08-3W-0100]  76.3,15.2 90 top
J10  FPC-15VERT  [1-1734248-5]  52.5,44.5 180 top
J11  FPC-15VERT  [1-1734248-5]  27.5,44.5 180 top
J12  JST-GH-6H  [JST-GH-6H]  3.14,37.5 270 top
J13  JST-GH-6H  [JST-GH-6H]  3.14,12.5 270 top
J14  JST-GH-4H  [JST-GH-4H]  76.86,30.75 90 top
L1  6.8uH  [1515]  10.45,4.8 0 top
L9  DLP11SN900HL2  [0504-DLP11S]  11.85,24.85 0 top
MP1  9774030151R  [WA-SMSI_9774___151]  68,36.5 180 top
MP2  9774030151R  [WA-SMSI_9774___151]  68,3.5 180 top
MP3  9774030151R  [WA-SMSI_9774___151]  20,36.5 180 top
MP4  9774030151R  [WA-SMSI_9774___151]  20,3.5 180 top
Q1  FDN360P  [SOT23]  31.6,6.75 0 top
Q3  FDN360P  [SOT23]  46.7,2.45 90 bottom
Q4  FDN360P  [SOT23]  51.8,2.75 90 bottom
Q5  [SOT23]  57.5,3 270 bottom
Q6  FDN360P  [SOT23]  34.95,6.4 270 top
R1  0R  [0201]  65.65,15 90 bottom
R2  DNP  [0201]  68.2,15 90 bottom
R3  0R  [0201]  67.35,15 90 bottom
R4  DNP  [0201]  66.5,15 90 bottom
R5  100K 1%  [0201]  31.1,17.65 270 bottom
R6  24K  [0201]  10.9,14.85 270 bottom
R7  22K  [0201]  12.05,16 180 bottom
R8  100K 1%  [0201]  26.9,4.15 0 bottom
R9  0R  [0201]  35.95,38.45 90 bottom
R10  1K5  [0201]  45.5,4.4 180 bottom
R11  12K1  [0201]  31.05,40.05 270 top
R12  10K 1%  [0201]  55.9,9.45 270 bottom
R13  10K 1%  [0201]  63.75,33.65 0 bottom
R14  0R  [0402]  42.75,9.5 180 bottom
R15  10K 1%  [0201]  62.6,12.1 0 bottom
R16  10K 1%  [0201]  63.25,13 0 bottom
R17  DNP  [0201]  62.8,28.05 270 bottom
R18  DNP  [0201]  59.55,27.6 270 bottom
R19  0R  [0201]  26.75,20.5 0 top
R20  1K5  [0201]  64.5,5.5 270 bottom
R21  10K 1%  [0201]  37.1,25.2 270 bottom
R22  DNP  [0201]  62.9,7.75 90 bottom
R23  DNP  [0201]  62.05,7.75 90 bottom
R24  240R0  [0201]  54.3,9.45 270 bottom
R25  33R0  [0201]  59.45,10.55 180 bottom
R26  1M0  [0402]  51.75,20.35 90 bottom
R27  1K5  [0201]  28.9,26 90 top
R28  1K5  [0201]  29.75,26 90 top
R29  220R  [0402]  71.5,6.3 180 bottom
R30  220R  [0402]  71.5,8.85 180 bottom
R31  10K 1%  [0201]  51.8,28.85 270 bottom
R32  220R  [0402]  71.5,11.4 180 bottom
R33  220R  [0402]  71.5,14 180 bottom
R34  220R  [0402]  71.5,16.45 180 bottom
R35  220R  [0402]  71.5,19 180 bottom
R36  220R  [0402]  71.5,21.55 180 bottom
R37  220R  [0402]  71.5,24.1 180 bottom
R38  47K  [0201]  69.4,25.2 0 bottom
R39  47K  [0201]  70.75,32.4 0 bottom
R40  DNP  [0201]  67.65,26.1 0 bottom
R41  DNP  [0201]  67.2,32.35 0 bottom
R42  0R  [0201]  36,36.25 0 bottom
R43  0R  [0201]  20.25,23.85 90 bottom
R44  10K 1%  [0201]  16.35,11.05 180 top
R45  10K 1%  [0201]  16.65,12.2 270 top
R46  DNP  [0201]  63.3,35.5 0 bottom
R47  10K 1%  [0201]  63.3,34.65 180 bottom
R48  10K 1%  [0201]  27.85,23.35 180 top
R49  14K7  [0201]  31.65,22.05 180 top
R50  100K 1%  [0201]  31.45,21.2 0 top
R51  DNP  [0201]  45.1,26.95 180 bottom
R52  0R  [0201]  38.3,21.1 90 bottom
R53  DNP  [0201]  40.1,24.45 180 bottom
R54  0R  [0201]  37.45,21.1 90 bottom
R55  10K 1%  [0201]  16.45,41 270 bottom
R56  10K 1%  [0201]  15.3,41.3 180 bottom
R57  DNP  [0201]  40.1,23.5 180 bottom
R58  0R  [0201]  20.25,25.3 270 bottom
R59  DNP  [0201]  42.9,27.2 90 bottom
R68  5K1  [0201]  10,24.35 0 bottom
R69  10K 1%  [0201]  28,32.4 0 top
R70  10K 1%  [0201]  34.15,36.85 90 top
R71  12K0  [0402]  53.25,29 0 bottom
R75  10K 1%  [0201]  39.45,13.46 0 bottom
R76  DNP  [0201]  39.45,14.3 0 bottom
R77  10K 1%  [0201]  58.55,31.6 90 bottom
R78  196R  [0201]  37.5,7.25 270 bottom
R79  100R  [0201]  41.15,7.2 90 bottom
R80  1M0  [0201]  10.2,3.1 270 bottom
R81  0R  [0402]  11.1,3.1 270 bottom
R82  0R  [0201]  9.8,28 270 top
R83  DNP  [0402]  13.65,4 270 bottom
R85  100R  [0201]  42,7.2 90 bottom
R86  DNP  [0201]  63.75,32.8 0 bottom
R87  DNP  [0201]  57.4,31.9 180 bottom
R88  DNP  [0201]  63.6,28.05 270 bottom
R89  5K1  [0201]  10,23.5 0 bottom
R90  0R  [0201]  63.9,20.65 270 bottom
R91  100K 1%  [0201]  26.15,12.1 90 bottom
R92  100K 1%  [0201]  22.5,12.55 180 bottom
R93  100K 1%  [0201]  25.1,15.2 0 bottom
R95  10K 1%  [0201]  40.15,15.15 0 bottom
R96  1M0  [0201]  29.65,9.1 0 top
R97  100K 1%  [0201]  24.45,12.1 90 bottom
R98  100K 1%  [0201]  25.3,12.1 270 bottom
R99  100K 1%  [0201]  25.1,14.35 0 bottom
R100  100K 1%  [0201]  40.15,15.95 0 bottom
R101  0R  [0201]  53.1,6.5 90 bottom
R102  12K0  [0201]  31,11.55 0 bottom
R103  10K 1%  [0201]  60.5,5 0 bottom
R104  100K 1%  [0201]  26.9,2.45 0 bottom
R105  100K 1%  [0201]  26.9,3.3 0 bottom
R106  DNP  [0201]  53.95,6.5 90 bottom
R107  0R  [0201]  63.45,19.15 270 bottom
R108  1K5  [0201]  63.05,20.65 270 bottom
R109  1K5  [0201]  63.1,18 180 bottom
R110  1K5  [0201]  45.5,5.25 180 bottom
R111  24K  [0201]  13.3,14.85 270 bottom
R112  0R  [0201]  13.05,12.75 0 top
R113  0R  [0201]  41.2,5 270 bottom
R114  5K  [0201]  12.5,14.85 270 bottom
R115  5K  [0201]  11.7,14.85 270 bottom
R117  10K 1%  [0201]  68.1,47.7 0 top
R119  10K 1%  [0201]  12.85,45.72 180 bottom
R120  150R  [0201]  11.16,45.61 0 bottom
R123  DNP  [0201]  63.45,8.9 0 bottom
R124  DNP  [0201]  62,8.9 180 bottom
RP2  33R0  [741X16]  61.99,47 0 bottom
RP3  100K0  [741X16]  62,42 0 bottom
RT4  60R4  [0805]  70.7,47.2 270 top
RT5  60R4  [0805]  70.7,43.75 270 top
S1  EVQ  [EVQ]  11.25,46.25 90 top
S2  EVQ  [KMT0]  62.55,2.9 0 bottom
S3  EVQ  [KMT0]  42.65,14 270 bottom
U1  TPS2041BDGN  [MSOP8-PAD]  68.95,30.45 90 bottom
U2  TJA1051TK/3  [HVSON8]  67.8,45.65 0 top
U3  TPD4E02B0410-USON  [UFDFN-10]  77.75,43 0 bottom
U4  ASM1142  [QFN64-9X9MM-FT2232HQ]  29.5,35.75 0 bottom
U5  G313-06329-00  [G313-06329-00]  28.95,24.1 180 bottom
U6  [WDFN6]  29.65,22.8 0 top
U7  ICM-42605  [LGA14-2.5X3MM]  41.05,29.5 270 bottom
U8  TPD4E02B0410-USON  [UFDFN-10]  74.5,43 180 bottom
U9  BMM150  [WLCSP-12]  61.7,31.1 180 bottom
U10  DNP  [BA03]  43.55,24.45 270 bottom
U11  ICM-20602  [LGA16-3X3MM]  41.45,19.5 180 bottom
U12  ADP1740ACPZ-1.2-R7  [LFCSPWQ16]  26.45,29.8 180 top
U13  USB3300-EZK-TR  [QFN32-USB3300]  56.4,25.8 270 bottom
U14  USB2517-JZX  [QFN64-9X9MM-FT2232HQ]  27.45,14.6 180 top
U15  BMI088  [LGA16-BMI088]  39.35,10.55 270 bottom
U16  MIC94081  [FTDFN-4]  60.5,8.15 90 bottom
U17  TPD4E02B0410-USON  [UFDFN-10]  69.5,20.25 270 bottom
U18  TPD4E02B0410-USON  [UFDFN-10]  69.5,10 270 bottom
U19  [S-PVQFN-N14]  25.25,25.1 90 top
U25  TPS2041BDGN  [MSOP8-PAD]  69.25,27.05 270 top
U30  TS3A5223  [UQFN-10]  18.65,40.75 180 top
U100  STM32H753II  [LQFP176]  50.55,20 0 top
U101  MIC94081  [FTDFN-4]  46,19.85 180 bottom
U105  TPS2121  [VQFN12-HR]  12.1,14.9 0 top
U106  FM25V02A-DG  [DFN8-4X4.5]  48.45,29.65 0 bottom
U107  TPD4E02B0410-USON  [UFDFN-10]  9.8,25.6 90 top
U108  BMP388  [LGA10]  57,17.3 0 bottom
U109  MIC94081  [FTDFN-4]  43.35,7.75 0 bottom
U$2  DNP  [UPVERTER_LABEL_SMALL]  36.7,43.65 0 bottom
U$53  DNP  [GEPPETTO_HOLE_2.9]  2.5,47.5 0 top
U$55  DNP  [GEPPETTO_HOLE_2.9]  77.5,2.5 0 top
U$60  DNP  [GEPPETTO_HOLE_2.9]  77.5,47.5 0 top
Y1  24.000MHz  [CRYSTAL-3225]  25,7.95 180 bottom
Y2  16.000MHz  [CRYSTAL-3225]  52.15,11.65 270 bottom
Y3  32.768KHz CL6  [1206]  46.6,10.85 0 bottom
Y4  24.000MHz  [CRYSTAL-3225]  49.25,22.05 270 bottom
Y5  20.000MHz  [CRYSTAL-3225]  29.4,36.85 180 top

## Tracks (layer width: path | path; a pad name or v marks a point on that pad's centre or on a via)
1.8V_OUT$7  (via drill 0.2)
  Top 0.254: J8.88 54.1,4.54 | J8.90 J8.88 | J8.88 54.25,4.19 v54.25,3.75 | Q1.3 31.6,7.6 v30.8,7.6
  Top 0.406: 54.1,4.54 v54.1,5.45
  Power 0.254: v54.25,3.75 54.25,4 53.65,4.6 33.8,4.6 v30.8,7.6
  Bottom 0.254: v54.1,5.45 54.1,6.06 R106.1
1.PWM1_PWM_
  Bottom 0.254: R29.2 J9.17
1.PWM2_PWM_
  Bottom 0.254: R30.2 J9.18
1.PWM3_PWM_
  Bottom 0.254: R32.2 J9.19
1.PWM4_PWM_
  Bottom 0.254: R33.2 73.69,14 J9.20
1.PWM5_PWM_
  Bottom 0.254: R34.2 73.74,16.45 J9.21
1.PWM6_PWM_
  Bottom 0.254: R35.2 J9.22
1.PWM7_PWM_
  Bottom 0.254: R36.2 J9.23
1.PWM8_PWM_
  Bottom 0.254: R37.2 J9.24
1.SD_CARD_POWER  (via drill 0.2)
  Power 0.406: v42.95,6.25 42.6,6.6 41.5,6.6 40.35,5.45 37.35,5.45 35.6,7.2 35.6,13.6 33.15,16.05 33.15,17.4 31.55,19 19.8,19 15.6,23.2 15.6,29.5 16.35,30.25 16.35,35.5 16.7,35.85 16.7,38.35 18.3,39.95 18.3,45.25 22.05,49 38.8,49 39.9,47.9 49.55,47.9 50.84,46.61 v50.84,46.05
  Bottom 0.254: U109.1_1 43.55,7.54 U109.1_2 43.77,6.83 43.2,6.25 v42.95,6.25 | RP3.1 RP3.2 RP3.3 RP3.4 RP3.5 RP3.6 | C14.1 44.75,46.25 46.85,46.25 47.05,46.45 47.05,46.85 47.3,47.1 49.55,47.1 50.84,45.81 J3.4
  Bottom 0.406: J3.4 v50.84,46.05 50.84,47.24 51.55,47.95 56.6,47.95 57.7,46.85 57.7,45.3 58.55,44.45 61.8,44.45 62.5,43.75 RP3.1 | RP3.2 64.19,43.25 C15.1
1.USB_HS_D_N  (via drill 0.2)
  Top 0.2: v58.53,28.82 58.44,28.91 59.18,29.65 60.48,29.65 63.7,32.87 63.7,34.43 61.1,37.03 61.1,37.5 v61.23,37.5 | v60.48,35.8 60.35,35.8 60.35,35.47 59.73,34.85 57.43,34.85 56.73,34.15 45.7,34.15 v45.7,34.02 | v36.33,32 36.2,32 36.2,31.47 35.95,31.22 35.95,11.82 35.03,10.9 31.9,10.9 U14.1
  Bottom 0.2: v58.53,28.82 58.44,28.91 58.1,28.57 58.1,28.17 U13.8 | v61.23,37.5 61.1,37.5 61.1,36.92 60.35,36.17 60.35,35.8 v60.48,35.8 | v45.7,34.02 45.7,34.15 40.43,34.15 39.08,32.8 36.58,32.8 36.2,32.42 36.2,32 v36.33,32
1.USB_HS_D_P  (via drill 0.2)
  Top 0.2: v58.07,29.28 58.16,29.19 59.02,30.05 60.32,30.05 63.3,33.03 63.3,34.27 60.7,36.87 60.7,37.5 v60.57,37.5 | v59.82,35.8 59.95,35.8 59.95,35.63 59.57,35.25 57.27,35.25 56.57,34.55 45.7,34.55 v45.7,34.68 | v35.67,32 35.8,32 35.8,31.63 35.55,31.38 35.55,11.98 34.87,11.3 31.9,11.3 U14.2
  Bottom 0.2: U13.7 57.7,28.17 57.7,28.73 58.16,29.19 v58.07,29.28 | v60.57,37.5 60.7,37.5 60.7,37.08 59.95,36.33 59.95,35.8 v59.82,35.8 | v45.7,34.68 45.7,34.55 40.27,34.55 38.92,33.2 36.42,33.2 35.8,32.58 35.8,32 v35.67,32
2.3.3V_VCC_3.3  (via drill 0.2, 0.2 pad 0.46)
  Top 0.254: 50.8,8.04 v50.86,8.1 50.86,7.31 U100.23 | 46.8,8.04 v46.86,8.1 46.86,7.31 U100.15 | 57.28,7.27 v57.28,8.1 57.3,8.08 U100.36 | 38.59,17.75 v38.65,17.69 37.86,17.69 U100.159 | U100.103 54.3,31.75 v54.25,31.7 | U100.149 37.86,22.69 v38.7,22.69 | U100.136 37.86,29.19 v38.65,29.19 | U100.91 v60.3,31.95 60.3,31.85 | U100.72 v64.15,22.75 | U100.62 v64.15,17.75 | U100.49 v62.45,11.25 | U100.114 v48.8,33.5 | U100.172 v36.95,11.25 | U100.82 62.45,27.75 62,28.2 v62,28.25 | J10.1_15 v59.5,45.55 | D2.4 v4,5.95 | IC5.1 9.8,39.55 v9.75,39.6 | U2.5 v69.25,44.01 v69.25,44 C3.1 | U30.1 18.85,41.8 v19.25,41.8 | J11.1_15 v34.5,45.6 | U14.24 27.7,18.45 28,18.15 v28.45,18.15 | U14.10 v30.95,15.35 | U14.5 31.05,12.85 v30.95,12.75 | U14.64 31.25,10.1 v32,10.1 | U14.57 v27.7,10.85 | U14.52 25.2,10.9 25,11.1 v24.05,11.1 24.05,11.3 23.5,11.85 U14.46 | C76.1 v32.25,39 | C86.1 v28.75,39.55 | v33,38 C88.1 33.65,37.4 33.91,37.14 R70.2 | C85.1 v25.9,37.45 | C73.1 v26,34.5 | C77.1 31.05,33.76 v31.05,33 | U100.127 42.3,32.05 42,31.75 v42,31.65
  Power 0.254: v40.25,13.45 40.55,13.75 41.4,13.75 | 28.75,38.85 v28.75,39.55
  Bottom 0.254: 50.84,8.08 v50.86,8.1 50.86,8.47 C57.1 | C58.1 46.84,8.08 v46.86,8.1 47.1,8.1 C263.1 | C45.1 57.28,7.66 v57.28,8.1 | C42.1 v62.45,11.25 | FB3.1 60.55,9.63 v60.55,9.05 60.7,8.89 U16.3_2 60.7,8.46 U16.3_1 | R12.1 v55.9,10.15 | C234.1 v62,28.25 | 38.63,17.71 v38.65,17.69 38.5,17.69 C227.1 | S3.3 v43.6,11.95 | v43.75,9.5 R14.2 42.85,9.12 42.85,8.5 42.92,8.43 U109.3_2 43.03,8.06 U109.3_1 | C235.1 54.31,31.76 v54.25,31.7 54.25,30.65 C50.1 | v54.5,26.55 U13.30 U13.31 53.39,27.05 C37.1 v53.25,27.65 C25.1 | U13.6 v57.15,28.8 C20.1 | R18.1 v59.55,28.35 | 46.45,31.1 U106.8 46.27,31.07 v45.9,30.7 45.59,30.39 C49.1 | U13.16 58.77,23.48 v58.8,23.45 58.8,22.79 C257.1 | U13.25 53.95,24.05 v53.95,23.35 53.95,23.14 C29.1 | R31.2 v51.8,27.95 | U101.3_1 46.2,19.2 v46.25,19.15 | C261.1 60.3,32.64 v60.3,31.95 | C236.1 42,31.5 v42,31.65 | C256.1 v38.7,22.69 | C229.1 38.65,28.79 v38.65,29.19 | C26.1 v48.8,33.5 | S3.4 43.35,15.47 v43.35,14.15 | C43.1 63.6,17.2 v64.15,17.75 | C44.1 v64.15,22.75 | R23.1 v62.44,7.46 v62.45,7.45 v62.46,7.46 R22.1 | U101.3_2 46.65,19.64 v46.65,19.55 | IC5.1 C247.1 9.8,39.55 v9.75,39.6 | 12.15,36.7 IC6.5 12.1,36.85 C243.1 | IC5.1 9.75,38.95 | IC5.1 9.85,38.85 10.75,38.85 11.39,38.21 | 11.37,36.88 C243.1 | 11.39,38.21 C243.1 | 11.39,38.21 11.86,38.21 IC6.1 | R119.2 13.2,45.72 v13.61,45.31 | R75.1 39.75,13.45 v40.25,13.45 | C68.1 36.61,11.25 v36.95,11.25 | v28.45,18.15 28.45,17.73 C8.1 | C9.1 27.98,17.73 C8.1 | C8.1 arc-90 29.11,17.84 C238.1 v30.49,17.84 v30.5,17.85 30.59,17.94 R5.1 | C241.1 31.04,15.44 v30.95,15.35 | C240.1 31,12.8 v30.95,12.75 | C7.1 v32,10.1 | v27.7,10.85 C13.1 26.7,11.26 R91.1 R98.2 R97.1 24.05,11.41 v24.05,11.1
  Bottom 0.254: v24.05,11.1 24.14,11.01 C248.1 | C239.1 23.45,11.7 v24.05,11.1 | v32.25,39 U4.62 | v28.75,39.55 U4.55 | v33,38 U4.4 | U4.24 29.75,32.25 v30,32.25 30.75,33 v31.05,33 31.2,33 31.75,32.45 U4.20 | v25.9,37.45 25.85,37.5 U4.44 | U4.38 v26,34.5 26,33.9 26.65,33.25 26.65,32.2 26.55,32.1 26.05,32.1 25.75,31.8 U4.32
  Bottom 0.305: R38.2 v68.6,25.2 | R39.2 69.9,32.96 v69.9,33.15 | J5.1 74.78,31.15 74.78,30.75 v76.6,30.75
  Bottom 0.406: v17.5,46.6 33.75,46.6 34.5,45.85 v34.5,45.6
  other vias: 9.85,1.8 10.85,1.8 11.85,1.8 13.35,1.8 13.85,1.8 28.75,32.25 29.35,32.25 23,46.6 27,46.6
  pour Power (rank 2): 36.55,6 64.55,6 64.55,34 36.55,34
  pour Top: 10.95,6.7 10.95,1.4 14.55,1.4 14.55,4.77 12.62,6.7
  pour Bottom: 9.55,2.7 9.55,1.4 14.55,1.4 14.55,2.7
  pour Power (rank 2): 63.5,49 41.5,49 41.5,43.5 63.5,43.5
  pour Power (rank 2): 38.5,49 16.5,49 16.5,43.5 38.5,43.5
  pour Power (rank 6): 0,0 0,50 80,50 80,0
  pour Top: 26.8,27.25 26.8,28.55 28.05,28.55 28.05,32.5 30.25,32.5 30.25,30.2 28.8,30.2 28.8,27.25
3.3V_OUT$7  (via drill 0.2)
  Top 0.254: 53.3,4.54 J8.86 J8.84 53.3,4.34
  Top 0.406: 53.3,4.54 v53.3,5.45 | v53.3,3.75 53.3,4.34
  Bottom 0.254: v53.3,5.45 53.1,5.65 R101.1
  Bottom 0.406: 53.3,3.5 v53.3,3.75 | v53.3,3.75 v53.3,5.45 | Q4.3 53.3,3.15 v53.3,3.75
3.5.0V_VCC_5.0  (via drill 0.2)
  Top 0.254: J7.B4 6.42,23.88 6.7,23.6 v6.75,23.6 7.53,23.6 J7.A9 | J7.B9 5.97,26.4 6.55,26.4 v6.75,26.2 6.83,26.12 J7.A4 | U107.5 U107.6 9.8,26.6 v9.8,27.05 R82.2
  Top 0.406: U105.7 v15,14.55
  Bottom 0.305: R111.2 13.74,14.56 13.75,14.55
  Bottom 0.61: 11.25,27.25 12,26.5 12,22.8 15,19.8 v15,14.55 v14.25,14.55 13.75,14.55
  pour Power: 8.65,23.35 8.65,23.25 6.2,23.25
  pour Bottom: 8,23.25 3.5,23.3 3.5,28.05 12,28 12,26.5 8,26.5
3V3_SENSORS  (via drill 0.2, 0.2 pad 0.46)
  Top 0.254: v45.7,20.65 47.35,20.65 51.7,16.3 v52.45,16.3 | v56.25,15.8 56.25,14.7 v55.05,13.5 | v60.3,11.7 v61.95,11.7
  Power 0.254: 58.35,18.05 56.25,15.95 v56.25,15.8 | 58.35,18.05 60.7,20.4 | 60.7,20.4 61.1,20.8 | 61.1,20.8 61.1,23.8 61.85,24.55 61.85,26.5 60.7,27.65 60.7,30.1 61.85,31.25 | 61.85,31.25 v61.85,33 61.85,33.25 62.15,33.55 63.15,33.55 v64.25,34.65 | 61.85,31.25 62.1,31 v62.1,30.05 | 60.7,20.4 60.7,19.2 v62.25,17.65 v62.26,17.65 | v62.3,20.8 61.1,20.8 | v57.95,18.05 58.35,18.05
  Power 0.406: 40.4,19.45 v39.45,18.5 | 40.4,19.45 40.4,17.7 39.8,17.1 39.8,14.9 39.5,14.6 39.5,13.25 39.8,12.95 v39.8,12.25 39.8,10.34 38.7,9.24 v38.7,8.55 | 40.4,19.45 40.4,19.65 41,20.25 42.95,20.25 43.35,20.65 v45.7,20.65 45.7,21.35 41.8,25.25 v41.8,27.8
  Bottom 0.102: U9.E5 61.15,31.95 | U9.B2 62,30.3 62,30.15 v62.1,30.05 62.69,30.05 C55.1
  Bottom 0.254: U9.E5 | 61.15,31.95 61.15,32.45 | 61.15,32.45 61.15,32.9 61.25,33 v61.85,33 | U10.1 41.65,25.57 | C60.1 C59.1 | C61.1 39.45,17.99 v39.45,18.5 U11.1 40.73,18.5 U11.16 | C46.1 41.8,27.3 v41.8,27.8 U7.8 42.84,28.34 C47.1 C48.1 U7.5 | C46.1 41.8,27.28 v41.8,26.5 41.8,25.68 U10.1 | R59.2 41.98,27.49 arc90 C46.1 | U10.1 41.67,25.76 C54.1 40.4,25.4 39.81,24.81 R53.1 R57.1 | 45.7,20.16 U101.1_1 45.68,20.16 U101.1_2 | v55.05,13.5 57.6,13.5 58.9,12.2 59.8,12.2 v60.3,11.7 | R15.2 62.31,12.06 v61.95,11.7 | C53.1 61.15,32.45 | v52.45,16.3 52.8,16.3 53.15,15.95 53.75,15.95 54.25,16.45 54.85,16.45 55.29,16.01 C70.1 55.66,15.8 v56.25,15.8 56.3,15.75 | U15.3 38.85,8.7 v38.7,8.55 38.7,8.21 C51.1 | C52.1 39.8,12.54 v39.8,12.25 39.8,11.76 U15.11 | R108.1 62.99,21 62.5,21 v62.3,20.8 | R109.1 62.6,18 v62.26,17.66 v62.26,17.65 | C71.1 57.5,18.39 U108.10 57.52,18.05 v57.95,18.05 57.95,17.73 U108.1 57.15,17.55 56.65,17.05 U108.6 | R47.2 v64.25,34.65
  Bottom 0.305: U11.16 40.95,17.65 41.28,17.32 C59.1 41.38,17.39
  Bottom 0.406: 45.7,20.16 v45.7,20.65 v45.7,21.25
3V3_SPEKTRUM  (via drill 0.2)
  Top 0.254: v78,39.5 77.75,39.5 76.75,40.5 76.75,41.25 76.25,41.75
  Top 0.305: J1.P4 76.25,41.75
  Bottom 0.254: U16.1_1 60.3,7.95 U16.1_2 60.3,6.46 60.7,6.05 62.7,6.05 63.95,7.3 67.95,7.3 71.15,4.1 75.75,4.1 77.55,5.9 77.55,28.65 77.35,28.85 77.35,30.65 77.7,31 77.7,39.2 v78,39.5
3V_MMC_CLK$24  (via drill 0.2)
  S14 0.102: v60.4,48.16 54.76,48.16 52.43,45.82 52.43,45.77 52.12,45.47 50.29,45.47 v49.78,45.97
  Bottom 0.102: v60.4,48.16 60.45,48.21 61.16,48.21 RP2.15 | v49.78,45.97 49.78,44.81 J3.5
3V_MMC_CMD$24  (via drill 0.2)
  S14 0.102: v60.4,48.77 54.81,48.77 v51.97,45.92
  Bottom 0.102: v60.4,48.77 61.16,48.77 RP2.16 | v51.97,45.92 51.97,44.81 J3.3
3V_MMC_D0$24  (via drill 0.2)
  S14 0.102: v60.2,47.55 54.46,47.55 52.63,45.72 52.63,45.67 52.22,45.26 48.31,45.26 v47.6,45.97
  Bottom 0.102: v60.2,47.55 60.35,47.7 61.16,47.7 RP2.14 | v47.6,45.97 47.6,44.81 J3.7
3V_MMC_D1$24  (via drill 0.2)
  S14 0.102: v60.2,46.94 55.12,46.94 54.56,46.38 53.65,46.38 52.32,45.06 45.16,45.06 44.96,45.26 v44.81,45.26
  Bottom 0.102: v60.2,46.94 60.5,47.24 61.16,47.24 RP2.13 | v44.81,45.26 45.97,45.26 46.43,44.81 J3.8
3V_MMC_D2$24  (via drill 0.2)
  S14 0.102: v60.1,46.23 54.71,46.23 v54.41,45.92
  Bottom 0.102: v60.1,46.23 60.6,46.74 61.16,46.74 RP2.12 | v54.41,45.92 54.36,45.87 54.36,45.01 54.15,44.81 J3.1
3V_MMC_D3$24  (via drill 0.2)
  S3 0.102: v62.43,44.7 53.85,44.7 v52.12,42.98
  Bottom 0.102: v62.43,44.7 62.33,44.81 60.76,44.81 60.55,45.01 60.55,45.97 60.81,46.23 61.16,46.23 RP2.11 | v52.12,42.98 52.12,43.48 52.98,44.35 J3.2
4.USB_D_N  (via drill 0.2)
  Top 0.2: L9.3 12.47,24.65 12.87,24.65 13.3,24.22 13.3,24.1 arc-90 12.95,23.75 arc90 12.6,23.4 12.6,23.28 arc90 12.95,22.93 arc-90 13.3,22.58 13.3,20.07 18.6,14.77 18.6,8.97 20.87,6.7 27.67,6.7 28.25,6.12 28.25,5.5 v28.12,5.5 | v28.12,7.6 28.25,7.6 28.25,10.15 U14.58
  Bottom 0.2: v28.12,5.5 28.25,5.5 28.25,7.6 v28.12,7.6
4.USB_D_P  (via drill 0.2)
  Top 0.2: L9.2 12.47,25.05 13.03,25.05 13.7,24.38 13.7,20.23 19,14.93 19,9.13 21.03,7.1 27.83,7.1 28.65,6.28 28.65,5.5 v28.78,5.5 | v28.78,7.6 28.65,7.6 28.65,10.15 U14.59
  Bottom 0.2: v28.78,5.5 28.65,5.5 28.65,7.6 v28.78,7.6
5.USB_DEVICE_D_N
  Top 0.2: IC5.15 13.3,34.85 13.3,32.88 14.48,31.7 21.53,31.7 22.3,30.93 22.3,21.27 22.1,21.07 22.1,20.82 arc90 22.45,20.47 22.71,20.47 arc-90 23.06,20.12 23.06,20.05 arc-90 22.71,19.7 22.45,19.7 arc90 22.1,19.35 22.1,9.83 22.73,9.2 25.37,9.2 25.75,9.58 25.75,10.15 U14.53
5.USB_DEVICE_D_P
  Top 0.2: IC5.14 12.9,34.85 12.9,32.72 14.32,31.3 21.37,31.3 21.9,30.77 21.9,21.43 21.7,21.23 21.7,9.67 22.57,8.8 25.53,8.8 26.15,9.42 26.15,10.15 U14.54
5V_HIGH  (via drill 0.2)
  Top 0.254: U25.6 U25.7
  Top 1.016: C66.1 v71.5,28.55 71.5,28.18 U25.8 U25.7
  Bottom 0.254: C64.1 71.41,28.46 v71.5,28.55
  pour Top (isolate 0.254): 77.5,4.85 77.5,26.45 73.5,26.45 73.5,28.5 70.5,28.5 70.5,24.5 75.5,24.5 75.5,4.85
5V_PERIPHERAL  (via drill 0.2)
  Top 0.305: C271.1 64.6,44.46 64.6,43.05 66.05,41.6 66.65,41.6 67.1,41.15 70.9,41.15 72.75,39.3 72.75,38.9 72.9,38.75 v72.9,38.1
  Top 0.313: C271.1 65.53,45.33 U2.3
  Top 0.406: J14.P1 74.98,28.9 73.6,28.9 v72.75,29.75 | J1.P1 74.91,38.1 v72.9,38.1
  Top 0.61: J12.P1 5.01,40.65 v7.5,40.65
  Bottom 0.305: 73.4,28.75 72.75,29.4 v72.75,29.75
  Bottom 0.406: 73.4,28.75 C67.1 73.65,27.71 C65.1
  Bottom 0.61: 72.2,38.2 72.2,39.85 71,41.05 67.9,41.05 67,41.95 65.3,41.95 63.9,40.55 63.9,39.55 63.55,39.2 53.35,39.2 51.8,40.75 51.8,41.95 50.55,43.2 45.1,43.2 39.5,48.8 39.5,48.9 17.25,48.9 15.5,47.15 15.5,44.7 13.35,42.55 9.4,42.55 v7.5,40.65 v6.75,40.65 v6,40.65
  pour Bottom (isolate 0.254): 70,31 70,28.5 74,28.5 74,39 71.45,39 71.45,31
6.USB_DEVICE_D_N
  Top 0.2: IC2.15 18.25,23.05 18.25,21.8 arc90 18.6,21.45 18.86,21.45 arc-90 19.21,21.1 19.21,21 arc-90 18.86,20.65 18.6,20.65 arc90 18.25,20.3 18.25,20.18 20.65,17.78 20.65,9.33 21.83,8.15 26.27,8.15 26.75,8.63 26.75,10.15 U14.55
6.USB_DEVICE_D_P
  Top 0.2: IC2.14 17.85,23.05 17.85,20.02 20.25,17.62 20.25,9.17 21.67,7.75 26.43,7.75 27.15,8.47 27.15,10.15 U14.56
7.1.8V_VCC_1.8  (via drill 0.2)
  Top 0.254: v36.3,8.55 36.3,6.65 Q6.3 | R19.2 v27.05,20.85 27.05,22.84 R48.2 | v29,27.25 29,26.39 R27.2 R28.2 | U19.8 24.9,27.23 v24.9,27.3 | U19.1 25.8,23.18 v25.8,22.5
  Power 0.254: v36.55,18.1 33.8,18.1 32.05,19.85 27.2,19.85 27.05,20 v27.05,20.85 27.05,23.75 | v29,27.25 28.4,26.65 27.9,26.65 27.05,25.8 | 27.05,25.8 27.05,23.75 | 27.05,25.8 26.6,25.8 25.1,27.3 v24.9,27.3 | v25.8,22.5 27.05,23.75
  Bottom 0.254: v36.3,8.55 35.65,8.55 35.4,8.8 35.4,16.95 v36.55,18.1 36.95,18.5 36.95,22.6 37.2,22.85 37.35,22.85 37.55,23.05 37.55,23.85 37.36,24.04 C34.1 | U5.54 37.04,24.1 C34.1 | C34.1 R21.2
7.3.3V_VCC_3.3  (via drill 0.2)
  Top 0.254: R50.2 31.75,20.75 v31.5,20.5 28.85,20.5 28.65,20.7 C38.1 | U6.1 28.64,21.52 C38.1 | 28.7,21.14 C38.1 | U19.14 24.18,23.38 v24.15,23.4
  S14 0.254: v24.15,23.4 30.45,23.4 31.5,22.35 v31.5,20.5
  Bottom 0.254: R113.2 41.2,4.72 41.2,4.35 | 34.55,19.3 U5.64 | C27.1 34.55,16.65 C28.1 34.55,19.1 34.5,19.15 | U5.67 33.45,20.4 31.6,20.4 v31.5,20.5 | 34.55,19.6 U5.65 34.5,19.65 34.5,19.4
  Bottom 0.406: Q3.3 44.6,2.45 44.25,2.8 42.75,2.8 42.7,2.85
  Bottom 1.016: 34.5,19.4 34.5,19.15 34.5,5.05 35.2,4.35 41.2,4.35 42.7,2.85
  pour Bottom: 36.5,23.25 35,23.25 35,20.5 33.25,20.5 33.25,18.5 36.5,18.5
7.CAM0_C_N
  Top 0.2: J10.1_8 52.75,44.48 52.75,42.2 50.6,40.05 44.9,40.05 44.25,39.4 44.25,39 44.3,38.95 J2.40
7.CAM0_C_P
  Top 0.2: J10.1_9 53.25,44.48 53.25,42 50.8,39.55 45.1,39.55 44.75,39.2 44.75,39 44.7,38.95 J2.42
7.CAM0_D1_N
  Top 0.2: J10.1_2 46.75,44.48 46.75,43.2 46.2,42.65 44.9,42.65 44.5,43.05 44.5,43.35 43.65,44.2 42.4,44.2 41.9,43.7 J2.28
7.CAM0_D1_P
  Top 0.2: J10.1_3 47.25,44.48 47.25,43 46.4,42.15 44.7,42.15 44,42.85 44,43.15 43.45,43.7 42.6,43.7 42.4,43.5 42.4,39.25 42.3,39.15 J2.30
7.CAM0_D2_N
  Top 0.2: J10.1_5 49.75,44.48 49.75,42.9 48.25,41.4 44.15,41.4 43.05,40.3 43.05,39.15 43.1,39.1 J2.34
7.CAM0_D2_P
  Top 0.2: J10.1_6 50.25,44.48 50.25,42.7 48.45,40.9 44.35,40.9 43.55,40.1 43.55,39.15 43.5,39.1 J2.36
7.CAM1_C_N  (via drill 0.2)
  Top 0.2: J2.27 41.9,35.9 41.85,35.95 41.85,36.15 43.05,37.35 43.55,37.35 v43.55,37.48 | J11.1_8 27.75,44.48 27.75,45.75 29,47 36.25,47 36.75,47.5 36.75,48 v36.62,48
  Bottom 0.2: v43.55,37.48 43.55,37.35 45.4,37.35 47.4,39.35 47.4,41.5 47.1,41.8 44.3,41.8 39.6,46.5 37.55,46.5 36.75,47.3 36.75,48 v36.62,48
7.CAM1_C_P  (via drill 0.2)
  Top 0.2: J2.29 42.3,35.9 42.35,35.95 43.25,36.85 43.55,36.85 v43.55,36.72 | v37.38,48 37.25,48 37.25,47.3 36.45,46.5 29.2,46.5 28.25,45.55 28.25,44.48 J11.1_9
  Bottom 0.2: v43.55,36.72 43.55,36.85 45.6,36.85 47.9,39.15 47.9,41.7 47.3,42.3 44.5,42.3 39.8,47 37.75,47 37.25,47.5 37.25,48 v37.38,48
7.CAM1_D1_N  (via drill 0.2)
  Top 0.2: J11.1_2 21.8,44.48 21.8,42.7 23,41.5 35.6,41.5 37.65,43.55 38.95,43.55 v38.95,43.42 | J2.15 39.5,35.95 38.82,36.62 v38.82,37
  Bottom 0.2: v38.82,37 38.95,37 38.95,37.75 40.95,39.75 41.6,39.75 41.9,40.05 41.9,40.75 39.1,43.55 38.95,43.55 v38.95,43.42
7.CAM1_D1_P  (via drill 0.2)
  Top 0.2: J11.1_3 22.3,44.48 22.3,42.9 23.2,42 35.4,42 37.45,44.05 38.95,44.05 v38.95,44.18 | J2.17 39.9,36.25 39.58,36.58 v39.58,37
  Bottom 0.2: v39.58,37 39.45,37 39.45,37.55 41.15,39.25 41.85,39.25 42.4,39.8 42.4,40.95 39.3,44.05 38.95,44.05 v38.95,44.18
7.CAM1_D2_N  (via drill 0.2)
  Top 0.2: J11.1_5 24.75,44.48 24.75,43.25 25.35,42.65 35.2,42.65 36.2,43.65 36.2,44.2 37.05,45.05 38.45,45.05 v38.45,44.92 | v40.52,37.25 40.65,37.25 40.65,36.1 40.7,36.05 J2.21
  Bottom 0.2: v40.52,37.25 40.65,37.25 40.65,37.95 41.4,38.7 45,38.7 45.85,39.55 45.85,40.4 45.6,40.65 43.75,40.65 39.35,45.05 38.45,45.05 v38.45,44.92
7.CAM1_D2_P  (via drill 0.2)
  Top 0.2: J11.1_6 25.25,44.48 25.25,43.45 25.55,43.15 35,43.15 35.7,43.85 35.7,44.4 36.85,45.55 38.45,45.55 v38.45,45.68 | v41.28,37.25 41.15,37.25 41.15,36.05 41.1,36 J2.23
  Bottom 0.2: v41.28,37.25 41.15,37.25 41.15,37.75 41.6,38.2 45.2,38.2 46.35,39.35 46.35,40.6 45.8,41.15 43.95,41.15 39.55,45.55 38.45,45.55 v38.45,45.68
7.GPIO2_GPIO  (via drill 0.2)
  Top 0.102: J8.58 47.9,5.05 48.1,5.25 48.1,5.8 v48.05,5.85 | 23.15,25.1 U19.11 23.16,25.1 22.66,24.6 22.66,21.34 23.1,20.9 v23.4,20.9
  S3 0.102: v23.4,20.9 22.05,19.55 22.05,9.25 26.3,5 v26.45,5
  S14 0.102: v48.05,5.85 48.05,4.8 44,0.75 28.7,0.75 27.65,1.8 27.65,4 26.65,5 v26.45,5
7.GPIO3_GPIO  (via drill 0.2)
  Top 0.102: J8.56 47.5,5.3 v47.6,5.4 | v24,27.35 23.05,27.35 22.8,27.1 22.8,25.85 23.05,25.6 U19.10 23.7,25.6
  S3 0.102: v24,27.35 25.15,26.2 25.15,22.6 23.9,21.35 23.9,20.55 23.8,20.45 23.35,20.45 22.4,19.5 22.4,9.35 26.25,5.5 26.6,5.5 27,5.1 27,3.8 27.7,3.1 27.7,2.55 v28.1,2.15
  S14 0.102: v47.6,5.4 47.6,4.65 44,1.05 28.75,1.05 28.1,1.7 v28.1,2.15
7.GPIO4_GPIO  (via drill 0.2)
  Top 0.102: v47.14,5.84 47.14,4.57 J8.54 | v60.3,40.64 58.78,40.64 55.52,43.89 55.52,44.45 J10.1_11
  S3 0.102: v47.14,5.84 47.14,7.77 48.97,9.6 48.97,31.04 51.21,33.27 59.48,33.27 62.3,36.09 62.3,38.64 v60.3,40.64
7.GPIO5_GPIO  (via drill 0.2)
  Top 0.102: v31.29,45.82 30.53,45.06 30.53,44.5 J11.1_11 | J8.34 43.08,4.57 43.05,4.6 43.05,5.45 42.61,5.89 v41.91,5.89 v41.92,5.9
  S3 0.102: v41.91,5.89 41,6.8 39.75,6.8 39.45,6.5 38.65,6.5 38.3,6.85 36.1,6.85 33.65,9.3 32,9.3 31.4,9.9 31.4,18.85 33.05,20.5 33.05,28.65 32.05,29.65 v31.45,29.65 v31.44,29.66
  S14 0.102: v31.29,45.82 31.29,46.16 30.85,46.6 29.25,46.6 27.85,45.2 27.85,43.9 26.65,42.7 26.65,40.65 26.8,40.5 26.8,38.6 27.95,37.45 27.95,35.65 26.65,34.35 26.65,32 29,29.66 v31.44,29.66
7.GPIO6_GPIO  (via drill 0.2)
  Top 0.102: J8.30 42.35,4.59 42.35,5.2 v42.45,5.3 | U19.12 23.1,24.6 22.9,24.4 22.9,22.6 24.05,21.45 24.05,21 v24.65,20.4